# EAGLE design 24x16_RGB (EAGLE 6.5.0)

## Sheet 1 of 7
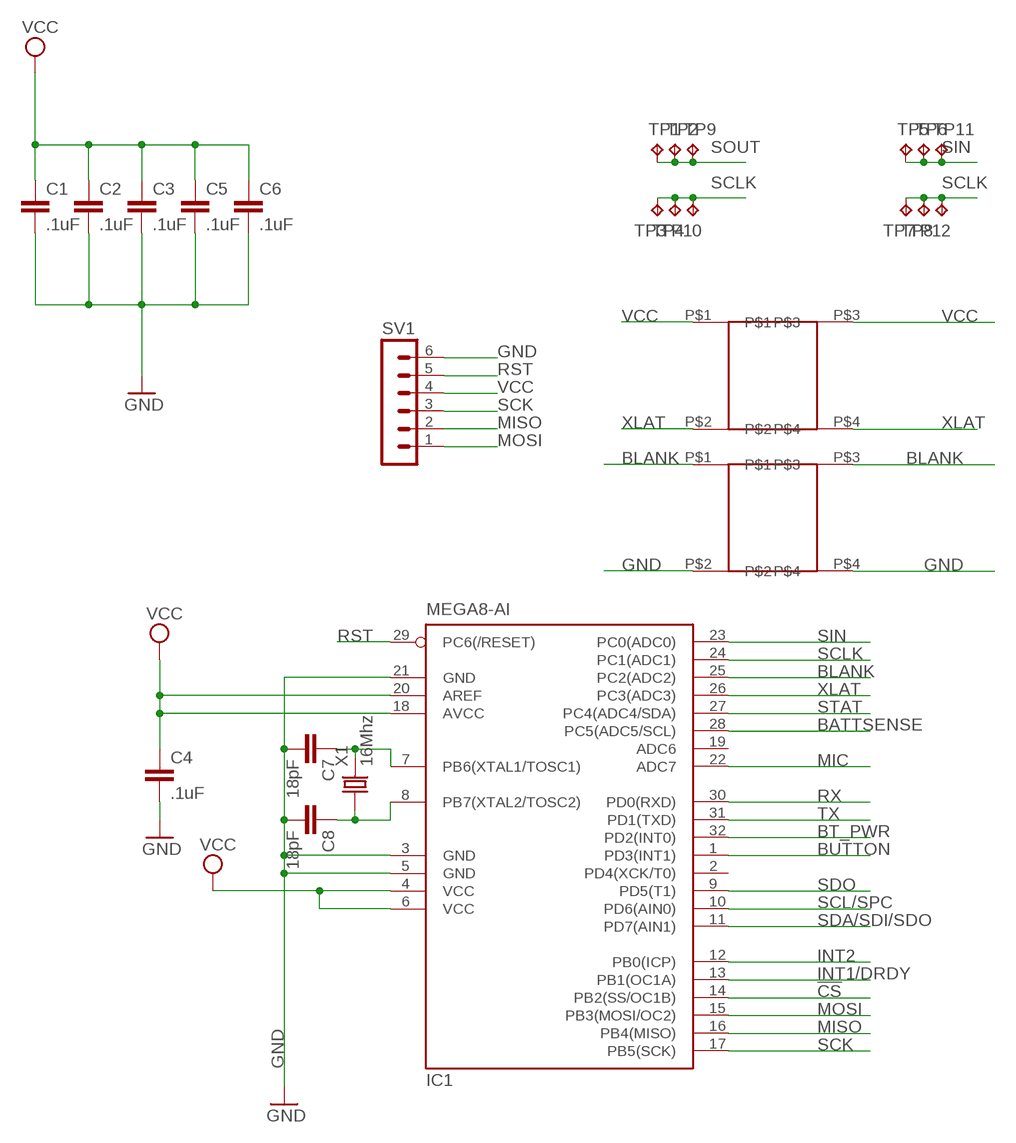
[diagram p0: schematic, sheet 1]

### Parts
C1  .1uF  CAP0805  [0805]
C2  .1uF  CAP0805  [0805]
C3  .1uF  CAP0805  [0805]
C4  .1uF  CAP0805  [0805]
C5  .1uF  CAP0805  [0805]
C6  .1uF  CAP0805  [0805]
C7  18pF  CAP0805  [0805]
C8  18pF  CAP0805  [0805]
IC1  MEGA8-AI  [TQFP32-08]
SLOT1  SLOT  [SLOT]
SLOT2  SLOT  [SLOT]
SV1  MA06-1  [MA06-1]
TP1  TPTP20SQ  [TP20SQ]
TP2  TPTP20SQ  [TP20SQ]
TP3  TPTP20SQ  [TP20SQ]
TP4  TPTP20SQ  [TP20SQ]
TP5  TPTP20SQ  [TP20SQ]
TP6  TPTP20SQ  [TP20SQ]
TP7  TPTP20SQ  [TP20SQ]
TP8  TPTP20SQ  [TP20SQ]
TP9  TPTP20SQ  [TP20SQ]
TP10  TPTP20SQ  [TP20SQ]
TP11  TPTP20SQ  [TP20SQ]
TP12  TPTP20SQ  [TP20SQ]
X1  16Mhz  CRYSTAL-5032  [5032]

### Nets
!CS: IC1.14(PB2(SS/OC1B)) ; also sheet 6
BATTSENSE: IC1.28(PC5(ADC5/SCL)) ; also sheet 4
BLANK: IC1.25(PC2(ADC2)) SLOT2.P$1 SLOT2.P$3 ; also sheet 2
BT_PWR: IC1.32(PD2(INT0)) ; also sheet 5
BUTTON: IC1.1(PD3(INT1)) ; also sheet 6
GND: C1.2 C2.2 C3.2 C4.2 C5.2 C6.2 C7.2 C8.2 IC1.3(GND) IC1.5(GND) IC1.21(GND) SLOT2.P$2 SLOT2.P$4 SV1.6 ; also sheet 2,4,5,6,7
INT1/DRDY: IC1.13(PB1(OC1A)) ; also sheet 6
INT2: IC1.12(PB0(ICP)) ; also sheet 6
MIC: IC1.22(ADC7) ; also sheet 7
MISO: IC1.16(PB4(MISO)) SV1.2
MOSI: IC1.15(PB3(MOSI/OC2)) SV1.1
N$7: C7.1 IC1.7(PB6(XTAL1/TOSC1)) X1.2
N$8: C8.1 IC1.8(PB7(XTAL2/TOSC2)) X1.1
RST: IC1.29(PC6(/RESET)) SV1.5 ; also sheet 6
RX: IC1.30(PD0(RXD)) ; also sheet 5
SCK: IC1.17(PB5(SCK)) SV1.3
SCL/SPC: IC1.10(PD6(AIN0)) ; also sheet 6
SCLK: IC1.24(PC1(ADC1)) TP3.TP TP4.TP TP7.TP TP8.TP TP10.TP TP12.TP ; also sheet 2
SDA/SDI/SDO: IC1.11(PD7(AIN1)) ; also sheet 6
SDO: IC1.9(PD5(T1)) ; also sheet 6
SIN: IC1.23(PC0(ADC0)) TP5.TP TP6.TP TP11.TP ; also sheet 2
SOUT: TP1.TP TP2.TP TP9.TP ; also sheet 2
STAT: IC1.27(PC4(ADC4/SDA)) ; also sheet 4
TX: IC1.31(PD1(TXD)) ; also sheet 5
VCC: C1.1 C2.1 C3.1 C4.1 C5.1 C6.1 IC1.4(VCC) IC1.6(VCC) IC1.18(AVCC) IC1.20(AREF) SLOT1.P$1 SLOT1.P$3 SV1.4 ; also sheet 2,3,4,5,6,7
XLAT: IC1.26(PC3(ADC3)) SLOT1.P$2 SLOT1.P$4 ; also sheet 2
Unconnected: IC1.2(PD4(XCK/T0)) IC1.19(ADC6)

## Sheet 2 of 7
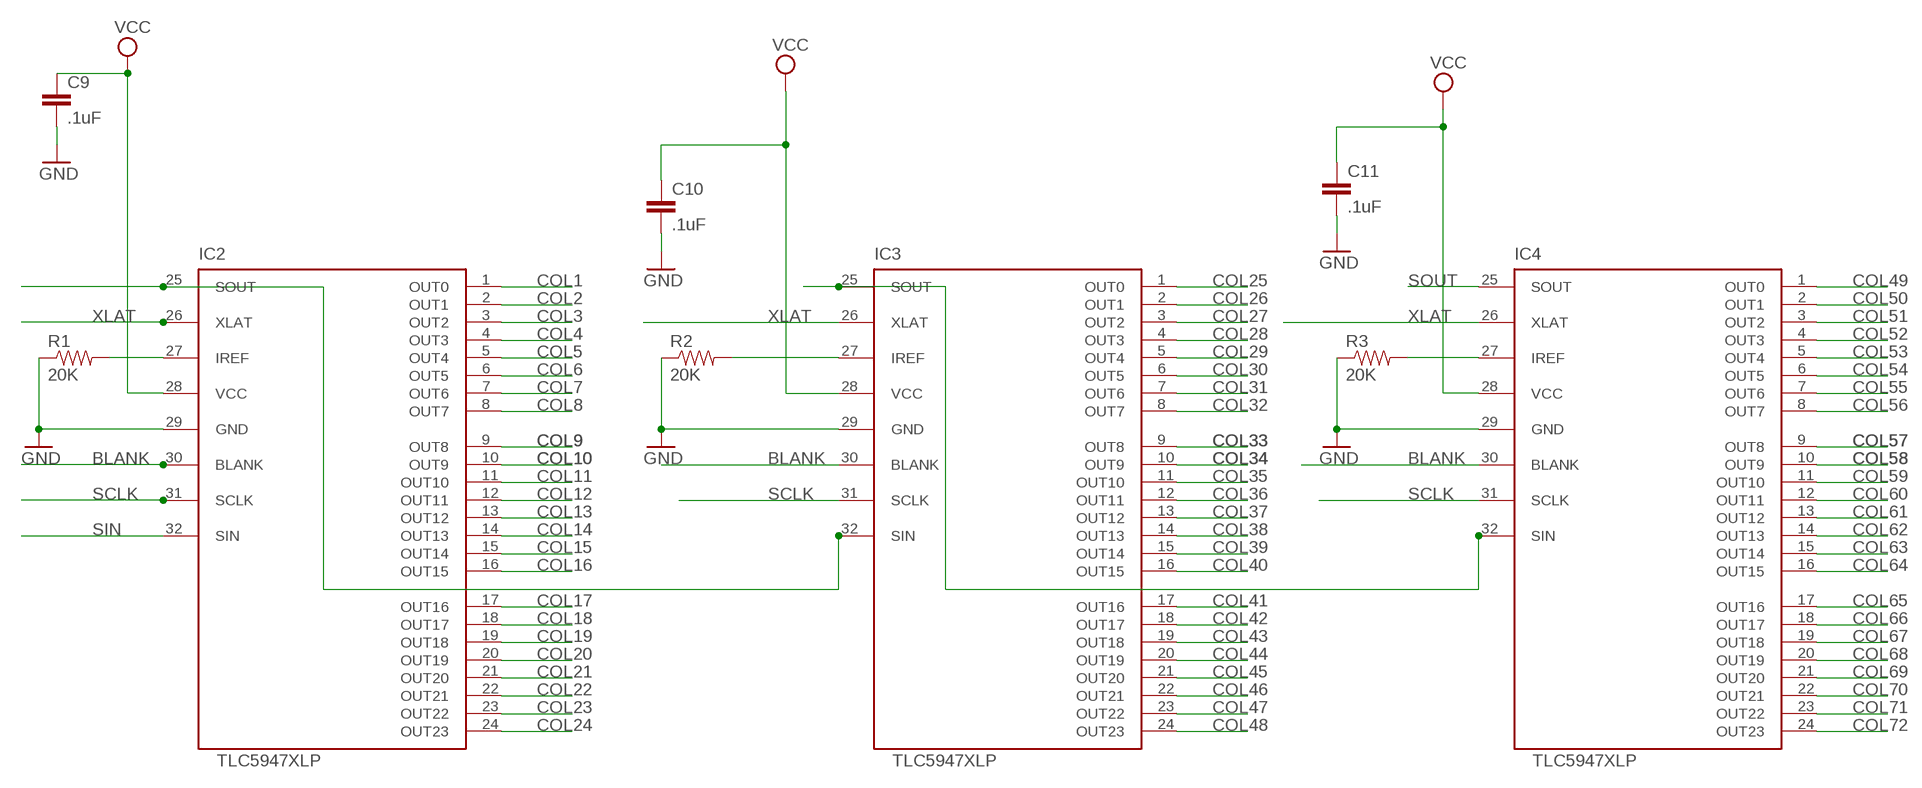
[diagram p1: schematic, sheet 2]

### Parts
C9  .1uF  CAP0805  [0805]
C10  .1uF  CAP0805  [0805]
C11  .1uF  CAP0805  [0805]
IC2  TLC5947XLP  [QFN32_XLP]
IC3  TLC5947XLP  [QFN32_XLP]
IC4  TLC5947XLP  [QFN32_XLP]
R1  20K  RESISTOR  [0805]
R2  20K  RESISTOR  [0805]
R3  20K  RESISTOR  [0805]

### Nets
BLANK: IC2.30(BLANK) IC3.30(BLANK) IC4.30(BLANK) ; also sheet 1
COL1: IC2.1(OUT0) ; also sheet 3
COL2: IC2.2(OUT1) ; also sheet 3
COL3: IC2.3(OUT2) ; also sheet 3
COL4: IC2.4(OUT3) ; also sheet 3
COL5: IC2.5(OUT4) ; also sheet 3
COL6: IC2.6(OUT5) ; also sheet 3
COL7: IC2.7(OUT6) ; also sheet 3
COL8: IC2.8(OUT7) ; also sheet 3
COL9: IC2.9(OUT8) ; also sheet 3
COL10: IC2.10(OUT9) ; also sheet 3
COL11: IC2.11(OUT10) ; also sheet 3
COL12: IC2.12(OUT11) ; also sheet 3
COL13: IC2.13(OUT12) ; also sheet 3
COL14: IC2.14(OUT13) ; also sheet 3
COL15: IC2.15(OUT14) ; also sheet 3
COL16: IC2.16(OUT15) ; also sheet 3
COL17: IC2.17(OUT16) ; also sheet 3
COL18: IC2.18(OUT17) ; also sheet 3
COL19: IC2.19(OUT18) ; also sheet 3
COL20: IC2.20(OUT19) ; also sheet 3
COL21: IC2.21(OUT20) ; also sheet 3
COL22: IC2.22(OUT21) ; also sheet 3
COL23: IC2.23(OUT22) ; also sheet 3
COL24: IC2.24(OUT23) ; also sheet 3
COL25: IC3.1(OUT0) ; also sheet 3
COL26: IC3.2(OUT1) ; also sheet 3
COL27: IC3.3(OUT2) ; also sheet 3
COL28: IC3.4(OUT3) ; also sheet 3
COL29: IC3.5(OUT4) ; also sheet 3
COL30: IC3.6(OUT5) ; also sheet 3
COL31: IC3.7(OUT6) ; also sheet 3
COL32: IC3.8(OUT7) ; also sheet 3
COL33: IC3.9(OUT8) ; also sheet 3
COL34: IC3.10(OUT9) ; also sheet 3
COL35: IC3.11(OUT10) ; also sheet 3
COL36: IC3.12(OUT11) ; also sheet 3
COL37: IC3.13(OUT12) ; also sheet 3
COL38: IC3.14(OUT13) ; also sheet 3
COL39: IC3.15(OUT14) ; also sheet 3
COL40: IC3.16(OUT15) ; also sheet 3
COL41: IC3.17(OUT16) ; also sheet 3
COL42: IC3.18(OUT17) ; also sheet 3
COL43: IC3.19(OUT18) ; also sheet 3
COL44: IC3.20(OUT19) ; also sheet 3
COL45: IC3.21(OUT20) ; also sheet 3
COL46: IC3.22(OUT21) ; also sheet 3
COL47: IC3.23(OUT22) ; also sheet 3
COL48: IC3.24(OUT23) ; also sheet 3
COL49: IC4.1(OUT0) ; also sheet 3
COL50: IC4.2(OUT1) ; also sheet 3
COL51: IC4.3(OUT2) ; also sheet 3
COL52: IC4.4(OUT3) ; also sheet 3
COL53: IC4.5(OUT4) ; also sheet 3
COL54: IC4.6(OUT5) ; also sheet 3
COL55: IC4.7(OUT6) ; also sheet 3
COL56: IC4.8(OUT7) ; also sheet 3
COL57: IC4.9(OUT8) ; also sheet 3
COL58: IC4.10(OUT9) ; also sheet 3
COL59: IC4.11(OUT10) ; also sheet 3
COL60: IC4.12(OUT11) ; also sheet 3
COL61: IC4.13(OUT12) ; also sheet 3
COL62: IC4.14(OUT13) ; also sheet 3
COL63: IC4.15(OUT14) ; also sheet 3
COL64: IC4.16(OUT15) ; also sheet 3
COL65: IC4.17(OUT16) ; also sheet 3
COL66: IC4.18(OUT17) ; also sheet 3
COL67: IC4.19(OUT18) ; also sheet 3
COL68: IC4.20(OUT19) ; also sheet 3
COL69: IC4.21(OUT20) ; also sheet 3
COL70: IC4.22(OUT21) ; also sheet 3
COL71: IC4.23(OUT22) ; also sheet 3
COL72: IC4.24(OUT23) ; also sheet 3
GND: C9.2 C10.2 C11.2 IC2.29(GND) IC3.29(GND) IC4.29(GND) R1.1 R2.1 R3.1 ; also sheet 1,4,5,6,7
HOLE: IC2.27(IREF) R1.2
N$2: IC3.27(IREF) R2.2
N$3: IC2.25(SOUT) IC3.32(SIN)
N$9: IC4.27(IREF) R3.2
N$19: IC3.25(SOUT) IC4.32(SIN)
SCLK: IC2.31(SCLK) IC3.31(SCLK) IC4.31(SCLK) ; also sheet 1
SIN: IC2.32(SIN) ; also sheet 1
SOUT: IC4.25(SOUT) ; also sheet 1
VCC: C9.1 C10.1 C11.1 IC2.28(VCC) IC3.28(VCC) IC4.28(VCC) ; also sheet 1,3,4,5,6,7
XLAT: IC2.26(XLAT) IC3.26(XLAT) IC4.26(XLAT) ; also sheet 1

## Sheet 3 of 7
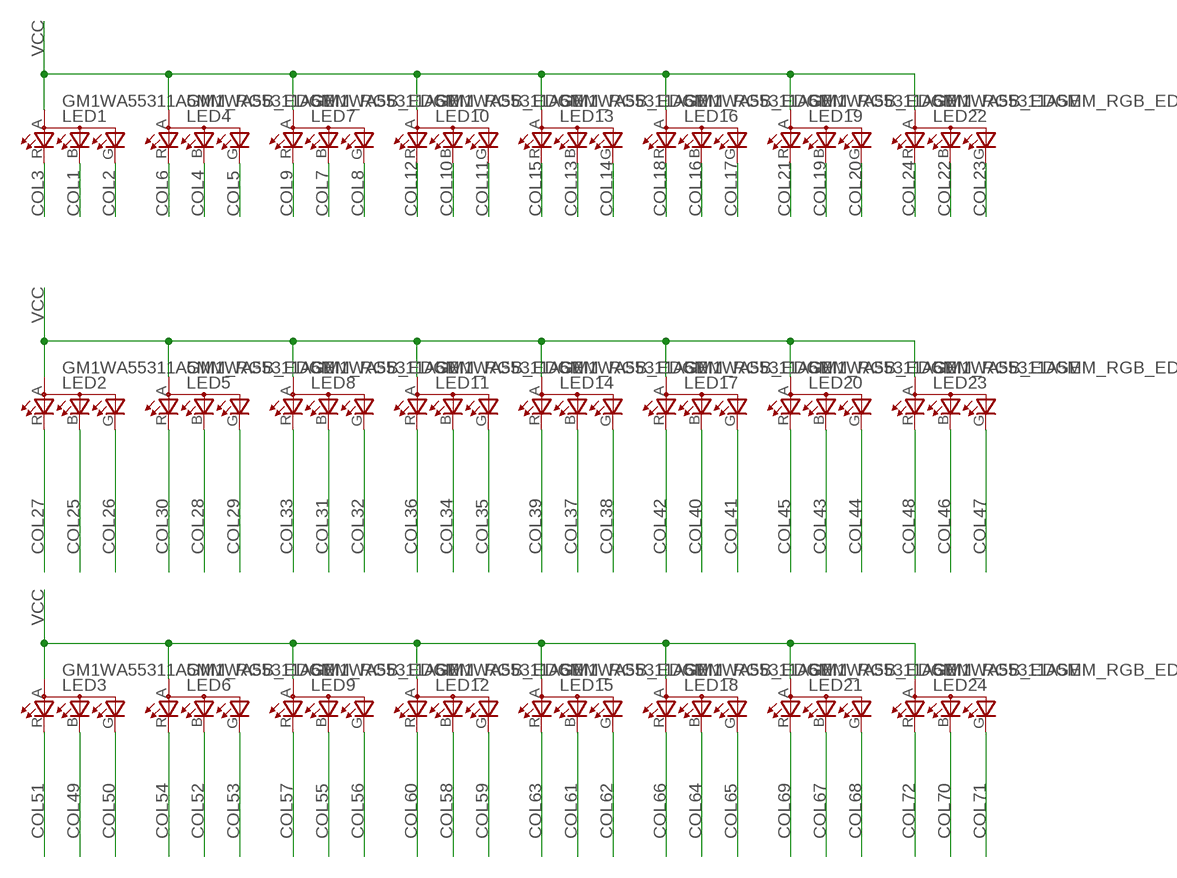
[diagram p2: schematic, sheet 3]

### Parts
LED1  GM1WA55311A5MM_RGB_EDGE  [LED5MM_RGB_EDGE]
LED2  GM1WA55311A5MM_RGB_EDGE  [LED5MM_RGB_EDGE]
LED3  GM1WA55311A5MM_RGB_EDGE  [LED5MM_RGB_EDGE]
LED4  GM1WA55311A5MM_RGB_EDGE  [LED5MM_RGB_EDGE]
LED5  GM1WA55311A5MM_RGB_EDGE  [LED5MM_RGB_EDGE]
LED6  GM1WA55311A5MM_RGB_EDGE  [LED5MM_RGB_EDGE]
LED7  GM1WA55311A5MM_RGB_EDGE  [LED5MM_RGB_EDGE]
LED8  GM1WA55311A5MM_RGB_EDGE  [LED5MM_RGB_EDGE]
LED9  GM1WA55311A5MM_RGB_EDGE  [LED5MM_RGB_EDGE]
LED10  GM1WA55311A5MM_RGB_EDGE  [LED5MM_RGB_EDGE]
LED11  GM1WA55311A5MM_RGB_EDGE  [LED5MM_RGB_EDGE]
LED12  GM1WA55311A5MM_RGB_EDGE  [LED5MM_RGB_EDGE]
LED13  GM1WA55311A5MM_RGB_EDGE  [LED5MM_RGB_EDGE]
LED14  GM1WA55311A5MM_RGB_EDGE  [LED5MM_RGB_EDGE]
LED15  GM1WA55311A5MM_RGB_EDGE  [LED5MM_RGB_EDGE]
LED16  GM1WA55311A5MM_RGB_EDGE  [LED5MM_RGB_EDGE]
LED17  GM1WA55311A5MM_RGB_EDGE  [LED5MM_RGB_EDGE]
LED18  GM1WA55311A5MM_RGB_EDGE  [LED5MM_RGB_EDGE]
LED19  GM1WA55311A5MM_RGB_EDGE  [LED5MM_RGB_EDGE]
LED20  GM1WA55311A5MM_RGB_EDGE  [LED5MM_RGB_EDGE]
LED21  GM1WA55311A5MM_RGB_EDGE  [LED5MM_RGB_EDGE]
LED22  GM1WA55311A5MM_RGB_EDGE  [LED5MM_RGB_EDGE]
LED23  GM1WA55311A5MM_RGB_EDGE  [LED5MM_RGB_EDGE]
LED24  GM1WA55311A5MM_RGB_EDGE  [LED5MM_RGB_EDGE]

### Nets
COL1: LED1.B(CBLUE) ; also sheet 2
COL2: LED1.G(CGREEN) ; also sheet 2
COL3: LED1.R(CRED) ; also sheet 2
COL4: LED4.B(CBLUE) ; also sheet 2
COL5: LED4.G(CGREEN) ; also sheet 2
COL6: LED4.R(CRED) ; also sheet 2
COL7: LED7.B(CBLUE) ; also sheet 2
COL8: LED7.G(CGREEN) ; also sheet 2
COL9: LED7.R(CRED) ; also sheet 2
COL10: LED10.B(CBLUE) ; also sheet 2
COL11: LED10.G(CGREEN) ; also sheet 2
COL12: LED10.R(CRED) ; also sheet 2
COL13: LED13.B(CBLUE) ; also sheet 2
COL14: LED13.G(CGREEN) ; also sheet 2
COL15: LED13.R(CRED) ; also sheet 2
COL16: LED16.B(CBLUE) ; also sheet 2
COL17: LED16.G(CGREEN) ; also sheet 2
COL18: LED16.R(CRED) ; also sheet 2
COL19: LED19.B(CBLUE) ; also sheet 2
COL20: LED19.G(CGREEN) ; also sheet 2
COL21: LED19.R(CRED) ; also sheet 2
COL22: LED22.B(CBLUE) ; also sheet 2
COL23: LED22.G(CGREEN) ; also sheet 2
COL24: LED22.R(CRED) ; also sheet 2
COL25: LED2.B(CBLUE) ; also sheet 2
COL26: LED2.G(CGREEN) ; also sheet 2
COL27: LED2.R(CRED) ; also sheet 2
COL28: LED5.B(CBLUE) ; also sheet 2
COL29: LED5.G(CGREEN) ; also sheet 2
COL30: LED5.R(CRED) ; also sheet 2
COL31: LED8.B(CBLUE) ; also sheet 2
COL32: LED8.G(CGREEN) ; also sheet 2
COL33: LED8.R(CRED) ; also sheet 2
COL34: LED11.B(CBLUE) ; also sheet 2
COL35: LED11.G(CGREEN) ; also sheet 2
COL36: LED11.R(CRED) ; also sheet 2
COL37: LED14.B(CBLUE) ; also sheet 2
COL38: LED14.G(CGREEN) ; also sheet 2
COL39: LED14.R(CRED) ; also sheet 2
COL40: LED17.B(CBLUE) ; also sheet 2
COL41: LED17.G(CGREEN) ; also sheet 2
COL42: LED17.R(CRED) ; also sheet 2
COL43: LED20.B(CBLUE) ; also sheet 2
COL44: LED20.G(CGREEN) ; also sheet 2
COL45: LED20.R(CRED) ; also sheet 2
COL46: LED23.B(CBLUE) ; also sheet 2
COL47: LED23.G(CGREEN) ; also sheet 2
COL48: LED23.R(CRED) ; also sheet 2
COL49: LED3.B(CBLUE) ; also sheet 2
COL50: LED3.G(CGREEN) ; also sheet 2
COL51: LED3.R(CRED) ; also sheet 2
COL52: LED6.B(CBLUE) ; also sheet 2
COL53: LED6.G(CGREEN) ; also sheet 2
COL54: LED6.R(CRED) ; also sheet 2
COL55: LED9.B(CBLUE) ; also sheet 2
COL56: LED9.G(CGREEN) ; also sheet 2
COL57: LED9.R(CRED) ; also sheet 2
COL58: LED12.B(CBLUE) ; also sheet 2
COL59: LED12.G(CGREEN) ; also sheet 2
COL60: LED12.R(CRED) ; also sheet 2
COL61: LED15.B(CBLUE) ; also sheet 2
COL62: LED15.G(CGREEN) ; also sheet 2
COL63: LED15.R(CRED) ; also sheet 2
COL64: LED18.B(CBLUE) ; also sheet 2
COL65: LED18.G(CGREEN) ; also sheet 2
COL66: LED18.R(CRED) ; also sheet 2
COL67: LED21.B(CBLUE) ; also sheet 2
COL68: LED21.G(CGREEN) ; also sheet 2
COL69: LED21.R(CRED) ; also sheet 2
COL70: LED24.B(CBLUE) ; also sheet 2
COL71: LED24.G(CGREEN) ; also sheet 2
COL72: LED24.R(CRED) ; also sheet 2
VCC: LED1.A LED2.A LED3.A LED4.A LED5.A LED6.A LED7.A LED8.A LED9.A LED10.A LED11.A LED12.A LED13.A LED14.A LED15.A LED16.A LED17.A LED18.A LED19.A LED20.A LED21.A LED22.A LED23.A LED24.A ; also sheet 1,2,4,5,6,7

## Sheet 4 of 7
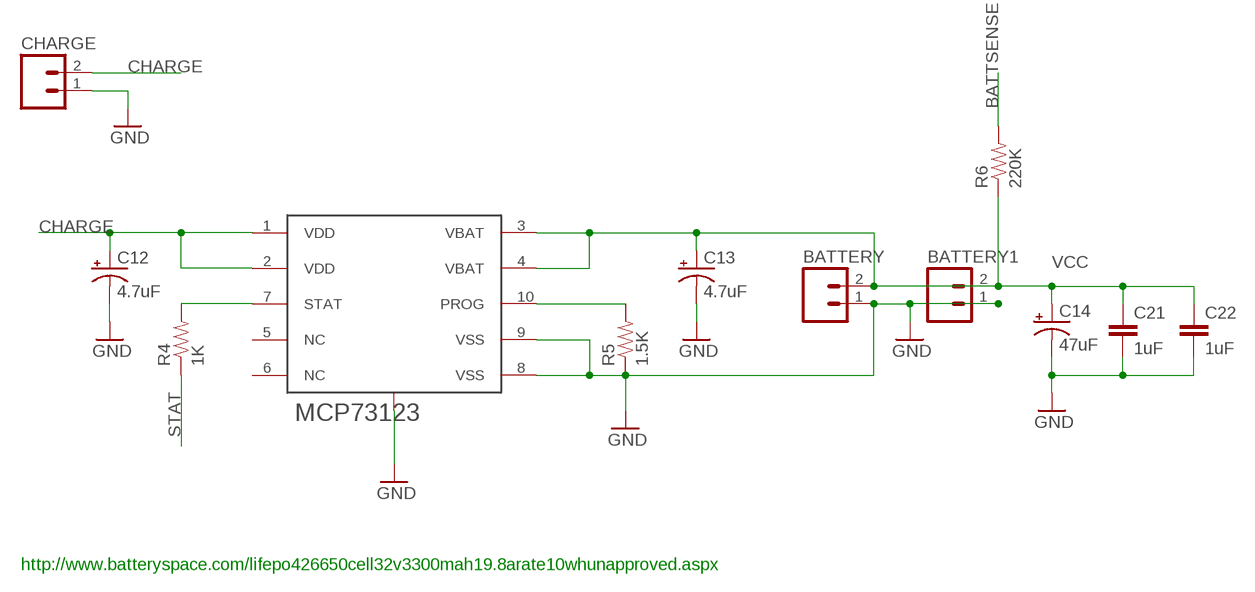
[diagram p3: schematic, sheet 4]

### Parts
BATTERY  M02PTH  [1X02]
BATTERY1  M02PTH  [1X02]
C12  4.7uF  CAP_POL3528  [EIA3528]
C13  4.7uF  CAP_POL3528  [EIA3528]
C14  47uF  CAP_POL3528  [EIA3528]
C21  1uF  CAP0805  [0805]
C22  1uF  CAP0805  [0805]
CHARGE  M02PTH  [1X02]
IC5  MCP73123  [DFN10_3X3]
R4  1K  RESISTOR0805  [0805]
R5  1.5K  RESISTOR0805  [0805]
R6  220K  RESISTOR0805  [0805]

### Nets
BATTSENSE: R6.2 ; also sheet 1
CHARGE: C12.A(+) CHARGE.2 IC5.1(VDD) IC5.2(VDD)
GND: BATTERY1.1 BATTERY.1 C12.C(-) C13.C(-) C14.C(-) C21.2 C22.2 CHARGE.1 IC5.8(VSS) IC5.9(VSS) IC5.EXP(GND) R5.1 ; also sheet 1,2,5,6,7
N$1: IC5.7(STAT) R4.2
N$6: IC5.10(PROG) R5.2
STAT: R4.1 ; also sheet 1
VCC: BATTERY1.2 BATTERY.2 C13.A(+) C14.A(+) C21.1 C22.1 IC5.3(VBAT) IC5.4(VBAT) R6.1 ; also sheet 1,2,3,5,6,7
Unconnected: IC5.5(NC) IC5.6(NC)

### Notes on the sheet
- http://www.batteryspace.com/lifepo426650cell32v3300mah19.8arate10whunapproved.aspx

## Sheet 5 of 7
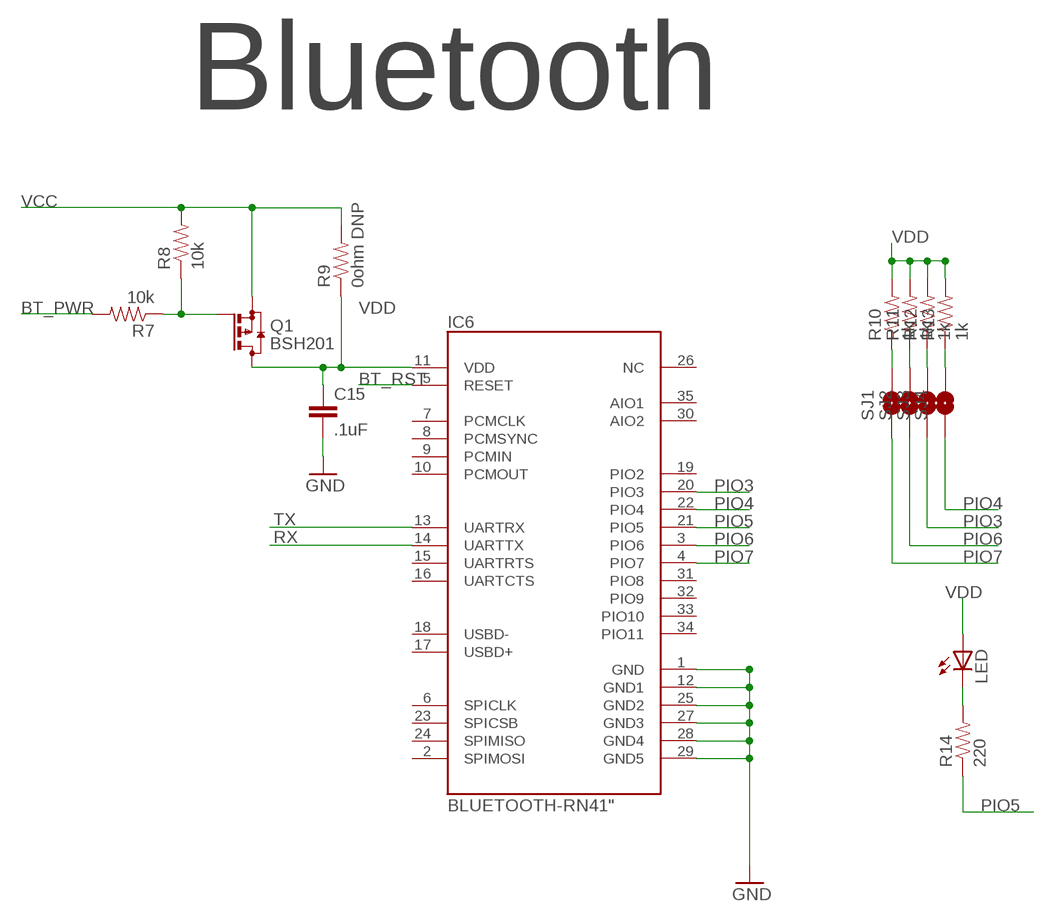
[diagram p4: schematic, sheet 5]

### Parts
C15  .1uF  CAP0805  [0805]
IC6  BLUETOOTH-RN41"  [RN41]
LED  LEDCHIP-LED0603  [CHIP-LED0603]
Q1  BSH201  BSS84  [SOT23]
R7  10k  RESISTOR  [0805]
R8  10k  RESISTOR  [0805]
R9  0ohm DNP  RESISTOR  [0805]
R10  1k  RESISTOR  [0805]
R11  1k  RESISTOR  [0805]
R12  1k  RESISTOR  [0805]
R13  1k  RESISTOR  [0805]
R14  220  RESISTOR  [0805]
SJ1  SOLDERJUMPERNO  [SJ_2S-NO]
SJ2  SOLDERJUMPERNO  [SJ_2S-NO]
SJ3  SOLDERJUMPERNO  [SJ_2S-NO]
SJ4  SOLDERJUMPERNO  [SJ_2S-NO]

### Nets
BT_PWR: R7.2 ; also sheet 1
BT_RST: IC6.5(RESET) ; also sheet 6
GND: C15.2 IC6.1(GND) IC6.12(GND1) IC6.25(GND2) IC6.27(GND3) IC6.28(GND4) IC6.29(GND5) ; also sheet 1,2,4,6,7
N$4: LED.C R14.2
N$5: R10.1 SJ1.2
N$18: Q1.1(G) R7.1 R8.1
N$21: R12.1 SJ3.2
N$23: R11.1 SJ2.2
N$24: R13.1 SJ4.2
PIO3: IC6.20(PIO3) SJ3.1
PIO4: IC6.22(PIO4) SJ4.1
PIO5: IC6.21(PIO5) R14.1
PIO6: IC6.3(PIO6) SJ2.1
PIO7: IC6.4(PIO7) SJ1.1
RX: IC6.14(UARTTX) ; also sheet 1
TX: IC6.13(UARTRX) ; also sheet 1
VCC: Q1.2(S) R8.2 R9.2 ; also sheet 1,2,3,4,6,7
VDD: C15.1 IC6.11(VDD) LED.A Q1.3(D) R9.1 R10.2 R11.2 R12.2 R13.2
Unconnected: IC6.2(SPIMOSI) IC6.6(SPICLK) IC6.7(PCMCLK) IC6.8(PCMSYNC) IC6.9(PCMIN) IC6.10(PCMOUT) IC6.15(UARTRTS) IC6.16(UARTCTS) IC6.17(USBD+) IC6.18(USBD-) IC6.19(PIO2) IC6.23(SPICSB) IC6.24(SPIMISO) IC6.26(NC) IC6.30(AIO2) IC6.31(PIO8) IC6.32(PIO9) IC6.33(PIO10) IC6.34(PIO11) IC6.35(AIO1)

### Notes on the sheet
- Bluetooth

## Sheet 6 of 7
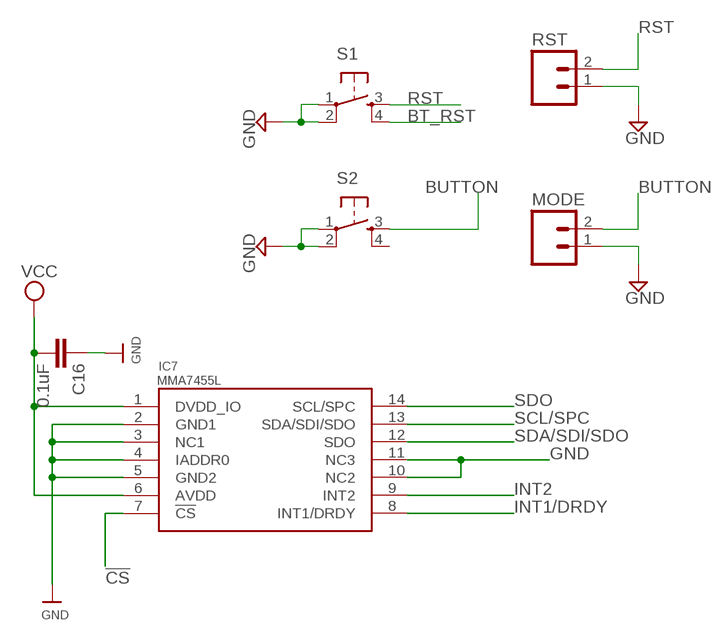
[diagram p5: schematic, sheet 6]

### Parts
C16  0.1uF  CAP0805  [0805]
IC7  MMA7455L  [LGA-14]
MODE  M02PTH  [1X02]
RST  M02PTH  [1X02]
S1  TAC_SWITCHSMD  [TACTILE_SWITCH_SMD]
S2  TAC_SWITCHSMD  [TACTILE_SWITCH_SMD]

### Nets
!CS: IC7.7(!CS) ; also sheet 1
BT_RST: S1.4 ; also sheet 5
BUTTON: MODE.2 S2.3 ; also sheet 1
GND: C16.1 IC7.2(GND1) IC7.3(NC1) IC7.4(IADDR0) IC7.5(GND2) IC7.10(NC2) IC7.11(NC3) MODE.1 RST.1 S1.1 S1.2 S2.1 S2.2 ; also sheet 1,2,4,5,7
INT1/DRDY: IC7.8(INT1/DRDY) ; also sheet 1
INT2: IC7.9(INT2) ; also sheet 1
RST: RST.2 S1.3 ; also sheet 1
SCL/SPC: IC7.13(SDA/SDI/SDO) ; also sheet 1
SDA/SDI/SDO: IC7.12(SDO) ; also sheet 1
SDO: IC7.14(SCL/SPC) ; also sheet 1
VCC: C16.2 IC7.1(DVDD_IO) IC7.6(AVDD) ; also sheet 1,2,3,4,5,7
Unconnected: S2.4

## Sheet 7 of 7
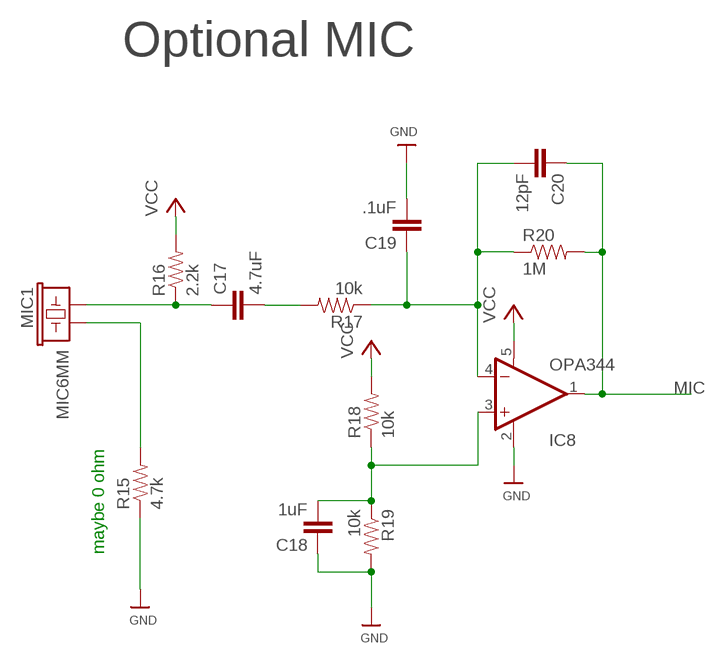
[diagram p6: schematic, sheet 7]

### Parts
C17  4.7uF  CAP0805  [0805]
C18  1uF  CAP0805  [0805]
C19  .1uF  CAP0805  [0805]
C20  12pF  CAP0805  [0805]
IC8  OPA344  [SOT23-5]
MIC1  MIC6MM  [MIC-6MM]
R15  4.7k  RESISTOR  [0805]
R16  2.2k  RESISTOR  [0805]
R17  10k  RESISTOR  [0805]
R18  10k  RESISTOR  [0805]
R19  10k  RESISTOR  [0805]
R20  1M  RESISTOR  [0805]

### Nets
GND: C18.1 C19.2 IC8.2(V-) R15.1 R19.2 ; also sheet 1,2,4,5,6
MIC: C20.1 IC8.1(OUT) R20.2 ; also sheet 1
N$14: C17.2 R17.2
N$15: C17.1 MIC1.1 R16.1
N$16: C18.2 IC8.3(+IN) R18.1 R19.1
N$17: C19.1 C20.2 IC8.4(-IN) R17.1 R20.1
N$20: MIC1.2 R15.2
VCC: IC8.5(V+) R16.2 R18.2 ; also sheet 1,2,3,4,5,6

### Notes on the sheet
- Optional MIC
- maybe 0 ohm

## Library data of the parts
BATTERY BATTERY1 CHARGE = SparkFun:M02: Header 2 Standard 2-pin 0.1" header. Use with straight break away headers (SKU : PRT-00116), right angle break away headers (PRT-00553), swiss pins (PRT-00743), machine pins (PRT-00117), and female headers (PRT-00115). Molex polarized connector foot print use with SKU : PRT-08233 with associated crimp pins and housings.; OC_NEWARK: unknown
C1-C6 C9-C11 = slice_noshift:CAP: Capacitor Standard 0603 ceramic capacitor, and 0.1" leaded capacitor.; MPN: 08055C105MAT2A; OC_NEWARK: 73T5385
C7 C8 = slice_noshift:CAP: Capacitor Standard 0603 ceramic capacitor, and 0.1" leaded capacitor.; MPN: 08051A180JAT2A; OC_NEWARK: 96M1325
C12 C13 = slice_noshift:CAP_POL: Capacitor Polarized These are standard SMD and PTH capacitors. Normally 10uF, 47uF, and 100uF in electrolytic and tantalum varieties. Always verify the external diameter of the through hole cap, it varies with capacity, voltage, and manufacturer. The EIA devices should be standard.; MPN: 0805YD475KAT2A; OC_NEWARK: 96M1306
C14 = slice_noshift:CAP_POL: Capacitor Polarized These are standard SMD and PTH capacitors. Normally 10uF, 47uF, and 100uF in electrolytic and tantalum varieties. Always verify the external diameter of the through hole cap, it varies with capacity, voltage, and manufacturer. The EIA devices should be standard.; OC_NEWARK: unknown
C15 C19 = SparkFun:CAP: Capacitor Standard 0603 ceramic capacitor, and 0.1" leaded capacitor.; MPN: 08055C105MAT2A; OC_NEWARK: 73T5385
C16 = SparkFun:CAP: Capacitor Standard 0603 ceramic capacitor, and 0.1" leaded capacitor.; MPN: 08055C104K4T2A; OC_NEWARK: 95W2729
C17 = SparkFun:CAP: Capacitor Standard 0603 ceramic capacitor, and 0.1" leaded capacitor.; MPN: 08053D475KAT2A; OC_NEWARK: 15P4053
C18 = SparkFun:CAP: Capacitor Standard 0603 ceramic capacitor, and 0.1" leaded capacitor.; MPN: 08055D105KAT2A; OC_NEWARK: 66M3779
C20 = SparkFun:CAP: Capacitor Standard 0603 ceramic capacitor, and 0.1" leaded capacitor.; MF: AVX CORPORATION; MPN: 08055A120JAT2A; OC_NEWARK: 30H0781
C21 C22 = 24x16_RGB:CAP: Capacitor Standard 0603 ceramic capacitor, and 0.1" leaded capacitor.; MPN: 08055D105KAT2A; OC_NEWARK: 66M3779
IC1 = atmel:MEGA8: MICROCONTROLLER 8 Kbytes FLASH, 1 kbytes SRAM, 512 bytes EEPROM, USART, 6-channel 10 bit ADC, 2-channel 8 bit ADC Pin compatible with Atmega48, ATMega88, ATMega168 Source: avr.lbr; MPN: ATMEGA8-16AU; OC_FARNELL: 9171371; OC_NEWARK: unknown
IC2-IC4 = slice_noshift:TLC5947; OC_NEWARK: unknown
IC5 = 24x16_RGB:MCP73123; MPN: MCP73123T-22SI/MF; OC_NEWARK: 14R8877
IC6 = NSL_Mini_Quad:BLUETOOTH-RN41; OC_NEWARK: unknown
IC7 = MMA7455Lbreakoutboard-v1a:MMA7455L; MPN: MMA7455LR2; OC_NEWARK: 69M3900
IC8 = SparkFun:OPA344; MPN: OPA344NA/250G4; OC_NEWARK: 13M5179
LED = led:LED: LED OSRAM: - CHIPLED LG R971, LG N971, LY N971, LG Q971, LY Q971, LO R971, LY R971 LH N974, LH R974 LS Q976, LO Q976, LY Q976 LO Q996 - Hyper CHIPLED LW Q18S LB Q993, LB Q99A, LB R99A - SideLED LS A670, LO A670, LY A670, LG A670, LP A670 LB A673, LV A673, LT A673, LW A673 LH A674 LY A675 LS A676, LA A676, LO A676, LY A676, LW A676 LS A679, LY A679, LG A679 - Hyper Micro SIDELED® LS Y876, LA Y876, LO Y876, LY Y876 LT Y87S - SmartLED LW L88C, LW L88S LB L89C, LB L89S, LG L890 LS L89K, LO L89K, LY L89K LS L896, LA L896, LO L896, LY L896 - TOPLED LS T670, LO T670, LY T670, LG T670, LP T670 LSG T670, LSP T670, LSY T670, LOP T670, LYG T670 LG T671, LOG T671, LSG T671 LB T673, LV T673, LT T673, LW T673 LH T674 LS T676, LA T676, LO T676, LY T676, LB T676, LH T676, LSB T676, LW T676 LB T67C, LV T67C, LT T67C, LS T67K, LO T67K, LY T67K, LW E67C LS E67B, LA E67B, LO E67B, LY E67B, LB E67C, LV E67C, LT E67C LW T67C LS T679, LY T679, LG T679 LS T770, LO T770, LY T770, LG T770, LP T770 LB T773, LV T773, LT T773, LW T773 LH T774 LS E675, LA E675, LY E675, LS T675 LS T776, LA T776, LO T776, LY T776, LB T776 LHGB T686 LT T68C, LB T68C - Hyper Mini TOPLED® LB M676 - Mini TOPLED Santana® LG M470 LS M47K, LO M47K, LY M47K Source: http://www.osram.convergy.de LUXEON: - LUMILED® LXK2-PW12-R00, LXK2-PW12-S00, LXK2-PW14-U00, LXK2-PW14-V00 LXK2-PM12-R00, LXK2-PM12-S00, LXK2-PM14-U00 LXK2-PE12-Q00, LXK2-PE12-R00, LXK2-PE12-S00, LXK2-PE14-T00, LXK2-PE14-U00 LXK2-PB12-K00, LXK2-PB12-L00, LXK2-PB12-M00, LXK2-PB14-N00, LXK2-PB14-P00, LXK2-PB14-Q00 LXK2-PR12-L00, LXK2-PR12-M00, LXK2-PR14-Q00, LXK2-PR14-R00 LXK2-PD12-Q00, LXK2-PD12-R00, LXK2-PD12-S00 LXK2-PH12-R00, LXK2-PH12-S00 LXK2-PL12-P00, LXK2-PL12-Q00, LXK2-PL12-R00 Source: www.luxeon.com KINGBRIGHT: KA-3528ASYC Source: www.kingbright.com; OC_NEWARK: unknown
LED1-LED24 = 24x16_RGB:GM1WA55311A: Chip LED RGB Source: http://document.sharpsma.com/files/GM1WA55311A_SS.pdf; OC_NEWARK: unknown
MIC1 = slice_noshift:MIC: Microphone Omni-directional electret microphone. 9.7mm standard diameter.; OC_NEWARK: unknown
MODE RST = 24x16_RGB:M02: Header 2 Standard 2-pin 0.1" header. Use with straight break away headers (SKU : PRT-00116), right angle break away headers (PRT-00553), swiss pins (PRT-00743), machine pins (PRT-00117), and female headers (PRT-00115). Molex polarized connector foot print use with SKU : PRT-08233 with associated crimp pins and housings.; OC_NEWARK: unknown
Q1 = transistor-small-signal:BSS84: P-CHANNEL MOS FET; MPN: BSH201,215; OC_NEWARK: 79R1832
R1-R3 = 24x16_RGB:RESISTOR: Resistor Basic schematic elements and footprints for 0603, 1206, and PTH 1/10th watt (small) resistors.; OC_NEWARK: unknown
R4 = slice_noshift:RESISTOR: Resistor Basic schematic elements and footprints for 0603, 1206, and PTH 1/10th watt (small) resistors.; MF: VISHAY/DALE; MPN: CRCW08051K00FKEA; OC_NEWARK: 52K9723
R5 = slice_noshift:RESISTOR: Resistor Basic schematic elements and footprints for 0603, 1206, and PTH 1/10th watt (small) resistors.; OC_NEWARK: unknown
R6 = slice_noshift:RESISTOR: Resistor Basic schematic elements and footprints for 0603, 1206, and PTH 1/10th watt (small) resistors.; MPN: 08051A220KAT2A; OC_NEWARK: 96M1330
R7-R9 R14 R17-R20 = SparkFun:RESISTOR: Resistor Basic schematic elements and footprints for 0603, 1206, and PTH 1/10th watt (small) resistors.; OC_NEWARK: unknown
R10-R13 = SparkFun:RESISTOR: Resistor Basic schematic elements and footprints for 0603, 1206, and PTH 1/10th watt (small) resistors.; MF: VISHAY/DALE; MPN: CRCW08051K00FKTA; OC_NEWARK: 05F1507
R15 = SparkFun:RESISTOR: Resistor Basic schematic elements and footprints for 0603, 1206, and PTH 1/10th watt (small) resistors.; MPN: CRCW08054K70FKEA; OC_NEWARK: 61M5491
R16 = SparkFun:RESISTOR: Resistor Basic schematic elements and footprints for 0603, 1206, and PTH 1/10th watt (small) resistors.; MPN: CRCW08052K20FKEA; OC_NEWARK: 61M5457
S1 S2 = SparkFun:TAC_SWITCH: Momentary Switch Button commonly used for reset or general input. Spark Fun Electronics SKU : COM-00097; OC_NEWARK: unknown
SJ1-SJ4 = SparkFun:SOLDERJUMPER: Solder Jumper Standard SMD solder jumper. Used to automate production. Two varients : Normally Open and Normally Closed are the same, but have different paste layers. NC will have a large amount of paste and should jumper during reflow.; OC_NEWARK: unknown
SLOT1 SLOT2 = slice:SLOT; OC_NEWARK: unknown
SV1 = NSL:MA06-1: PIN HEADER; OC_NEWARK: unknown
TP1-TP12 = testpad:TP: Test pad; OC_NEWARK: unknown
X1 = NSL_MiniQuad:CRYSTAL*: CRYSTAL; OC_NEWARK: unknown

## Board
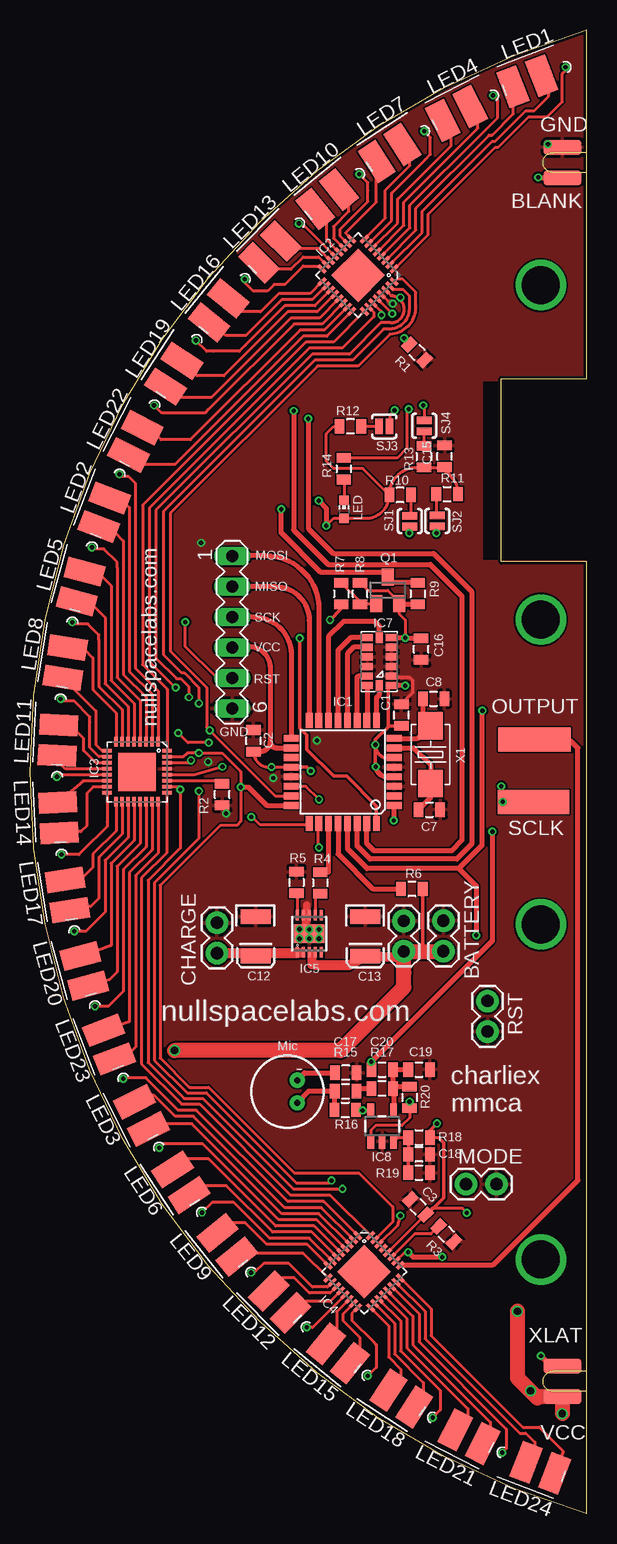
[diagram p7: board, top side]
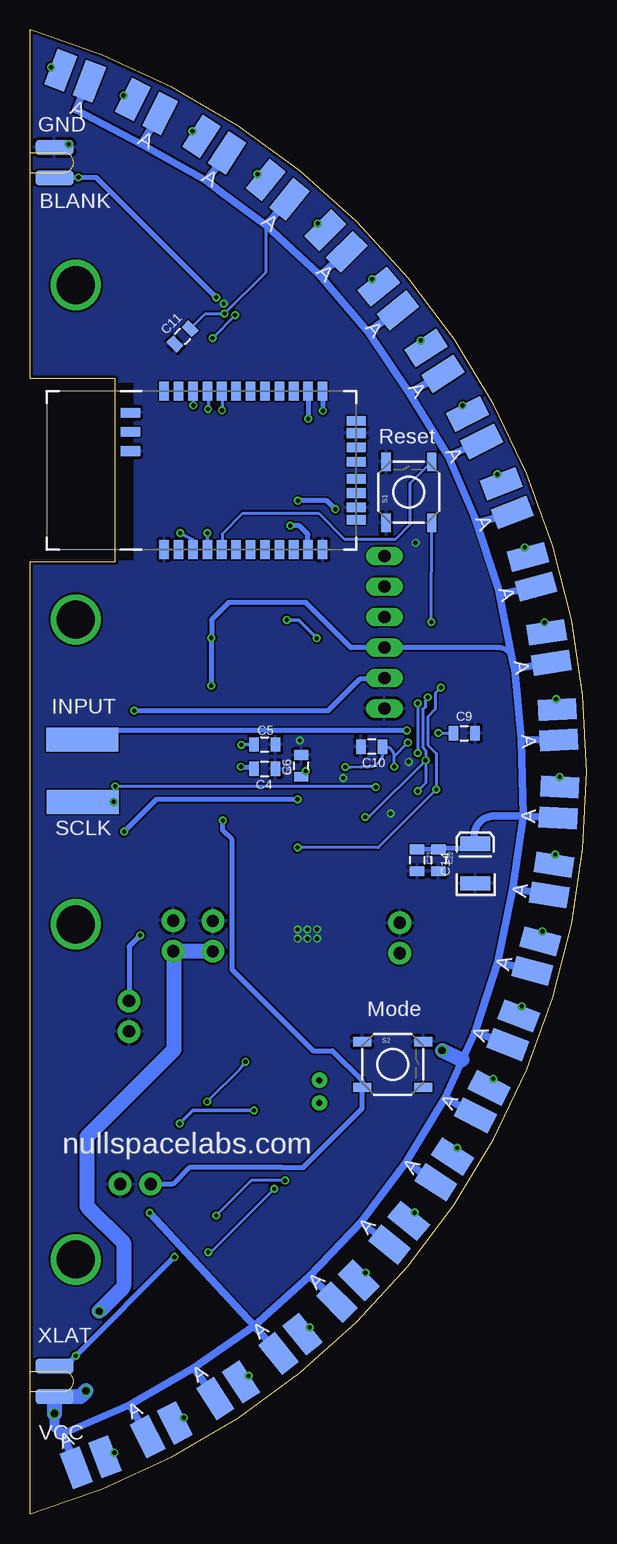
[diagram p8: board, bottom side, seen from below]

Size 46.39 x 123.7 mm. Coordinates in mm from the lower left corner, seen from the top.
Outline: 46.39,0 arc-147 46.39,123.7 46.39,94.61 39.27,94.61 39.27,79.38 46.39,79.38 46.39,0
Copper layers (1*16): Top 0.035mm / dielectric 1.5mm / Bottom 0.035mm
Design rules "ITead_rule": minimum track width 6mil, minimum drill 12mil, track to track 6mil, track to pad 6mil, pad to pad 6mil, via to via 6mil, smd to smd 0mil, copper to edge 10mil, drill to drill 10mil, minimum pad ring 10mil, minimum via ring 6mil, stop-mask expansion 2mil, vias tented up to drill 100mil, thermal gap 10mil

### Footprints (pad centres in the part's own frame; a part is rotated, then mirrored left to right if it is on the bottom)
1X02 = drill 1.016 pad 1.88: 1 0,0; 2 2.54,0
0805 = smd 0.8 x 1.2: 1 -0.9,0; 2 0.9,0
EIA3528 = smd 1.2 x 2.5: A 1.65,0; C -1.65,0
TQFP32-08 = smd 1.27 x 0.559: 1 -4.293,2.8; 2 -4.293,2; 3 -4.293,1.2; 4 -4.293,0.4; 5 -4.293,-0.4; 6 -4.293,-1.2; 7 -4.293,-2; 8 -4.293,-2.8; 17 4.293,-2.8; 18 4.293,-2; 19 4.293,-1.2; 20 4.293,-0.4; 21 4.293,0.4; 22 4.293,1.2; 23 4.293,2; 24 4.293,2.8 | smd 0.559 x 1.27: 9 -2.8,-4.293; 10 -2,-4.293; 11 -1.2,-4.293; 12 -0.4,-4.293; 13 0.4,-4.293; 14 1.2,-4.293; 15 2,-4.293; 16 2.8,-4.293; 25 2.8,4.293; 26 2,4.293; 27 1.2,4.293; 28 0.4,4.293; 29 -0.4,4.293; 30 -1.2,4.293; 31 -2,4.293; 32 -2.8,4.293
QFN32_XLP = smd 0.285 x 0.8: 1 -1.75,-2.5; 2 -1.25,-2.5; 3 -0.75,-2.5; 4 -0.25,-2.5; 5 0.25,-2.5; 6 0.75,-2.5; 7 1.25,-2.5; 8 1.75,-2.5; 17 1.75,2.5; 18 1.25,2.5; 19 0.75,2.5; 20 0.25,2.5; 21 -0.25,2.5; 22 -0.75,2.5; 23 -1.25,2.5; 24 -1.75,2.5 | smd 0.8 x 0.285: 9 2.5,-1.75; 10 2.5,-1.25; 11 2.5,-0.75; 12 2.5,-0.25; 13 2.5,0.25; 14 2.5,0.75; 15 2.5,1.25; 16 2.5,1.75; 25 -2.5,1.75; 26 -2.5,1.25; 27 -2.5,0.75; 28 -2.5,0.25; 29 -2.5,-0.25; 30 -2.5,-0.75; 31 -2.5,-1.25; 32 -2.5,-1.75 | smd 3.15 x 3.15: EP 0,0
DFN10_3X3 = smd 0.3 x 0.85: 1 -1,-1.55; 2 -0.5,-1.55; 3 0,-1.55; 4 0.5,-1.55; 5 1,-1.55; 6 1,1.55; 7 0.5,1.55; 8 0,1.55; 9 -0.5,1.55; 10 -1,1.55 | smd 2.48 x 1.55: EXP 0,0
RN41 = smd 0.8 x 1.6: 1 -6.6,-6.6; 2 -5.4,-6.6; 3 -4.2,-6.6; 4 -3,-6.6; 5 -1.8,-6.6; 6 -0.6,-6.6; 7 0.6,-6.6; 8 1.8,-6.6; 9 3,-6.6; 10 4.2,-6.6; 11 5.4,-6.6; 12 6.6,-6.6; 13 6.6,6.6; 14 5.4,6.6; 15 4.2,6.6; 16 3,6.6; 17 1.8,6.6; 18 0.6,6.6; 19 -0.6,6.6; 20 -1.8,6.6; 21 -3,6.6; 22 -4.2,6.6; 23 -5.4,6.6; 24 -6.6,6.6 | smd 1.6 x 0.8: 25 -9.4,4.8; 26 -9.4,3.2; 27 -9.4,1.6; 28 9.4,3.1; 29 9.4,-3.1; 30 9.4,-4.122; 31 9.4,-1.9; 32 9.4,-0.7; 33 9.4,0.7; 34 9.4,1.9; 35 9.4,4.122
LGA-14 = smd 0.6 x 0.9: 1 -2,-1; 2 -1.2,-1; 3 -0.4,-1; 4 0.4,-1; 5 1.2,-1; 6 2,-1; 8 2,1; 9 1.2,1; 10 0.4,1; 11 -0.4,1; 12 -1.2,1; 13 -2,1 | smd 0.9 x 0.6: 7 2,0; 14 -2,0
SOT23-5 = smd 0.55 x 1.2: 1 -0.95,-1.3; 2 0,-1.3; 3 0.95,-1.3; 4 0.95,1.3; 5 -0.95,1.3
CHIP-LED0603 = smd 0.8 x 0.8: A 0,-0.75; C 0,0.75
LED5MM_RGB_EDGE = smd 1.75 x 3.175 bottom: A -0.585,-1.6; B 1.971,-1.6 | smd 1.75 x 3.175: G 0.693,-1.6; R -1.863,-1.6
MIC-6MM = drill 0.5 pad 1.27: 1 -0.8,0.95; 2 -0.8,-0.95
SOT23 = smd 1 x 1.4: 1 -0.95,-1.1; 2 0.95,-1.1; 3 0,1.1
TACTILE_SWITCH_SMD = smd 1.524 x 0.762: 1 -2.54,1.905; 2 2.54,1.905; 3 -2.54,-1.905; 4 2.54,-1.905
SJ_2S-NO = smd 0.635 x 1.27: 1 -0.45,0; 2 0.45,0
SLOT = smd 3.175 x 1.27: P$1 2.032,1.27; P$2 2.032,-1.27 | smd 3.175 x 1.27 bottom: P$3 2.032,1.27; P$4 2.032,-1.27
MA06-1 = drill 1.016 long: 1 -6.35,0; 2 -3.81,0; 3 -1.27,0; 4 1.27,0; 5 3.81,0; 6 6.35,0
TP20SQ = smd 2 x 2: TP 0,0
5032 = smd 2.286 x 2.032: 1 -2.413,0; 2 2.413,0

### Placement (x,y rotation side)
BATTERY  31.15,49.43 270 top
BATTERY1  34.45,49.45 270 top
C1  30.94,66.6 90 top
C2  18.62,64.44 90 top
C3  32.34,25.59 135 top
C4  26.83,62.1 0 bottom
C5  26.83,64.13 0 bottom
C6  23.78,62.36 90 bottom
C7  33.28,58.7 0 top
C8  33.64,67.94 0 top
C9  10.19,65.07 0 bottom
C10  17.91,63.96 180 bottom
C11  33.68,98.15 225 bottom
C12  18.8,48.13 270 top
C13  27.95,48.13 270 top
C14  9.28,54.2 90 bottom
C15  34.54,88.16 90 top
C16  32.59,72.09 90 top
C17  26.3,35.23 0 top
C18  32.42,29.97 180 top
C19  32.42,37.03 0 top
C20  29.34,37.03 0 top
C21  14.13,54.48 270 bottom
C22  12.35,54.48 270 bottom
CHARGE  15.58,49.28 270 top
IC1  26.07,61.85 180 top
IC2  27.34,103.25 135 top
IC3  8.92,61.85 180 top
IC4  27.84,20.19 225 top
IC5  23.27,48.36 0 top
IC6  28.61,87 0 bottom
IC7  29.11,71.04 90 top
IC8  29.34,32.33 0 top
LED  26.17,83.74 0 top
LED1  41.41,121.13 21 top
LED2  4.91,84.6 69 top
LED3  7.59,33.02 117 top
LED4  35.34,118.43 27 top
LED5  2.83,78.28 75 top
LED6  10.91,27.26 123 top
LED7  29.58,115.11 33 top
LED8  1.45,71.78 81 top
LED9  14.82,21.89 129 top
LED10  24.21,111.2 39 top
LED11  0.75,65.17 87 top
LED12  19.26,16.95 135 top
LED13  19.26,106.75 45 top
LED14  0.75,58.53 93 top
LED15  24.21,12.5 141 top
LED16  14.84,101.79 51 top
LED17  1.45,51.92 99 top
LED18  29.58,8.59 147 top
LED19  10.96,96.41 57 top
LED20  2.83,45.42 105 top
LED21  35.34,5.27 153 top
LED22  7.61,90.65 63 top
LED23  4.88,39.09 111 top
LED24  41.41,2.57 159 top
MIC1  21.47,35.2 180 top
MODE  38.87,27.48 180 top
Q1  29.8,76.99 0 top
R1  32.24,96.83 135 top
R2  16.01,59.97 90 top
R3  34.69,23.32 135 top
R4  24.19,52.6 270 top
R5  22.21,52.63 270 top
R6  31.83,52.1 180 top
R7  25.94,76.71 270 top
R8  27.51,76.71 90 top
R9  32.32,76.71 270 top
R10  30.84,84.94 180 top
R11  34.75,85.01 0 top
R12  26.7,90.65 180 top
R13  32.82,88.14 270 top
R14  26.14,87.12 270 top
R15  26.32,36.78 180 top
R16  26.27,33.68 0 top
R17  29.34,35.46 180 top
R18  32.42,31.37 0 top
R19  32.42,28.45 0 top
R20  31.63,34.72 270 top
RST  38.13,40.21 90 top
S1  14.81,85.17 90 bottom
S2  16.16,37.46 0 bottom
SJ1  31.65,82.75 90 top
SJ2  33.94,82.78 90 top
SJ3  29.52,90.65 180 top
SJ4  32.85,90.7 270 top
SLOT1  46.39,11.05 180 top
SLOT2  46.39,112.65 180 top
SV1  16.85,73.48 270 top
TP1  42.04,64.57 0 top
TP2  40.04,64.57 0 top
TP3  41.97,59.36 0 top
TP4  39.99,59.36 0 bottom
TP5  42.04,64.57 0 bottom
TP6  40.04,64.57 0 bottom
TP7  43.97,59.36 0 bottom
TP8  41.99,59.36 0 bottom
TP9  44.05,64.57 0 top
TP10  39.99,59.36 0 top
TP11  44.05,64.57 0 bottom
TP12  43.95,59.36 0 top
X1  33.38,63.3 270 top

### Tracks (layer width: path | path; a pad name or v marks a point on that pad's centre or on a via)
!CS
  Top 0.406: IC1.14 24.87,73.13 26.14,74.4 28.73,74.4 29.11,74.02 IC7.7
BATTSENSE
  Top 0.406: IC1.28 25.67,55.01 28.58,52.09 R6.2
BLANK  (via drill 0.36)
  Top 0.254: v13.24,68.07 13.24,68.96 12.58,69.62 12.22,69.62 10.5,71.35 10.5,83.67 23.5,96.67 26.63,96.67 29.24,99.29 30.05,99.29 arc177 30.11,101.55 30.1,101.55 | v13.42,62.81 13.4,62.6 IC3.30 | IC4.30 30.62,24.03 v30.87,24.87 | v25.13,27.79 24.95,27.61 22.18,27.61 14.69,35.1 13.09,35.1 10.37,37.82 10.37,52.6 14.08,56.31 v14.08,60.25 | IC1.25 23.19,57.48 19.13,57.48 18.52,58.09 v18.45,58.09 | 30.1,101.55 IC2.30 | 30.1,101.55 30.1,101.57 v30.87,101.4 | 44.33,111.4 SLOT2.P$3
  Top 0.406: v42.35,111.4 44.33,111.4
  Bottom 0.254: v13.42,62.81 18.14,58.09 v18.45,58.09 | v14.08,60.25 13.42,60.91 v13.42,62.81 | v25.13,27.79 27.95,27.79 v30.87,24.87 | v42.35,111.4 42.37,111.38 | v13.24,68.07 13.44,67.79 13.44,67.26 13.67,67.11 13.67,63.91 13.42,63.65 v13.42,62.81
  Bottom 0.406: v30.87,101.4 40.87,111.4 v42.35,111.4 | 42.37,111.38 SLOT2.P$3
BT_PWR  (via drill 0.36)
  Top 0.305: IC1.32 28.87,59.02 26.4,61.49 25.3,61.49 23.07,63.73 23.07,64.72 23.07,64.92 22.49,65.51 v22.49,73 | v25,74.52 25.94,75.46 R7.2
  Bottom 0.305: v22.49,73 24.01,74.52 v25,74.52
BT_RST
  Bottom 0.254: S1.4 14.69,85.93 14.69,82.5 15.91,81.28 20.2,81.28 22.33,83.41 28.66,83.41 30.38,81.69 30.38,80.42
  Bottom 0.305: 30.38,80.42 IC6.5
BUTTON  (via drill 0.36)
  Top 0.406: v30.31,57.81 30.36,57.86 IC1.1
  Bottom 0.254: 18.65,35.46 S2.3
  Bottom 0.406: MODE.2 34.5,27.48 33.1,28.88 25.38,28.88 23.6,28.88 18.7,33.78 S2.3 18.7,36.12 21.19,38.61 22.79,38.61 29.55,45.36 29.55,56.21 30.31,56.97 v30.31,57.81
CHARGE
  Top 0.254: IC5.1 21.92,46.46 21.82,46.46 | 21.82,46.46 C12.A | 22.13,47.07 22.82,47.07 22.82,46.46 21.82,46.46 | 21.82,46.46 21.82,46.56
  Top 0.305: IC5.2 IC5.1 22.27,46.74
  Top 0.813: 22.27,46.74 CHARGE.2
COL1  (via drill 0.36)
  Top 0.254: IC2.1 33.18,106.62 33.18,108.33 38.77,113.92 39.02,113.92 41.56,116.46 42.83,116.46 43.11,116.46 44.35,117.7 44.35,120.04 44.63,120.32 v44.63,120.6
  Bottom 0.305: LED1.B 44.1,120.07 v44.63,120.6
COL2
  Top 0.254: IC2.2 32.67,106.82 32.67,108.58 38.51,114.43 38.77,114.43 41.31,116.97 42.02,116.97 43.21,118.16 43.21,119.31 LED1.G
COL3
  Top 0.254: IC2.3 32.16,107.02 32.16,108.84 38.26,114.94 38.51,114.94 40.29,116.71 40.29,118.75 LED1.R
COL4  (via drill 0.36)
  Top 0.254: IC2.4 31.65,107.22 31.65,109.09 37.67,115.09 38.97,116.38 38.97,117.6 38.97,117.86 v38.59,118.24
  Bottom 0.254: LED4.B arc-90 38.46,117.25 38.46,118.11 v38.59,118.24
COL5
  Top 0.254: IC2.5 31.15,107.41 31.15,109.35 37.32,115.52 37.32,116.15 36.68,116.79 LED4.G
COL6
  Top 0.254: IC2.6 30.64,107.61 30.64,109.6 35.08,114.05 35.08,114.96 34.4,115.64 LED4.R
COL7  (via drill 0.36)
  Top 0.254: IC2.7 30.13,107.81 30.13,110.11 32.92,112.9 33.36,113.33 33.36,114.76 v32.85,115.26
  Bottom 0.254: LED7.B 32.11,114.36 v32.85,115.26
COL8
  Top 0.254: IC2.8 29.62,108.01 29.62,110.36 31.65,112.39 31.65,113.06 31.5,113.21 31.5,113.67 LED7.G
COL9
  Top 0.254: IC2.9 26.32,106.74 26.32,106.81 28.86,109.35 28.86,112.39 LED7.R
COL10  (via drill 0.36)
  Top 0.254: IC2.10 25.81,106.54 25.81,107.06 27.59,108.84 28.15,109.4 28.15,110.31 28.15,110.97 v27.44,111.68
  Bottom 0.254: 26.74,110.88 LED10.B 26.95,111.19 v27.44,111.68 27.59,110.03
COL11
  Top 0.254: IC2.11 25.3,106.34 25.3,107.31 26.57,108.58 26.57,109.09 25.51,110.16 LED10.G
COL12
  Top 0.254: IC2.12 24.72,106.22 24.72,107.83 LED10.R
COL13  (via drill 0.36)
  Top 0.254: IC2.13 22.92,107.31 v22.41,107.57
  Bottom 0.254: LED13.B v22.41,107.57
COL14
  Top 0.254: IC2.14 24.07,105.46 21.9,105.46 21.25,106.11 LED13.G
COL15
  Top 0.254: IC2.15 24.04,104.78 22.76,104.78 21.75,103.76 20.05,103.76 19.5,104.3 LED13.R
COL16  (via drill 0.36)
  Top 0.254: IC2.16 24.1,104.01 22.76,104.01 21.24,102.49 20.35,102.49 19.79,101.93 18.6,101.93 17.89,102.64 v17.89,102.92
  Bottom 0.254: LED16.B 17.51,102.31 v17.89,102.92
COL17
  Top 0.254: IC2.17 23.34,101.73 20.73,101.73 19.21,100.2 17.43,100.2 16.53,101.1 LED16.G
COL18
  Top 0.254: IC2.18 23.54,101.22 20.99,101.22 17.99,98.22 16.31,98.22 15.2,99.33 LED16.R
COL19  (via drill 0.36)
  Top 0.254: IC2.19 23.74,100.71 21.24,100.71 17.94,97.41 17.46,96.93 15.27,96.93 14.71,96.93 v13.82,97.81
  Bottom 0.254: LED19.B 13.6,97.41 v13.82,97.81
COL20
  Top 0.254: IC2.20 23.94,100.2 21.49,100.2 16.16,94.87 13.93,94.87 LED19.G 12.86,95.88
COL21
  Top 0.254: IC2.21 24.13,99.69 21.75,99.69 15.12,93.07 12.66,93.07 11.75,93.97 LED19.R
COL22  (via drill 0.36)
  Top 0.254: IC2.22 24.33,99.19 22,99.19 14.89,92.07 14.59,91.77 11.46,91.77 10.98,91.77 v10.34,92.41
  Bottom 0.254: LED22.B 10.43,91.68 arc90 v10.34,92.41
COL23
  Top 0.254: IC2.23 24.53,98.68 22.51,98.68 13.37,89.53 10.93,89.53 10.55,89.92 9.98,89.92 LED22.G 10.07,90.29
COL24
  Top 0.254: IC2.24 24.73,98.17 22.76,98.17 12.07,87.48 8.98,87.48 LED22.R
COL25  (via drill 0.36)
  Top 0.254: IC3.1 10.67,68.61 8.79,70.48 8.79,85.9 8.21,86.49 7.63,86.49 v7.45,86.66
  Bottom 0.254: LED2.B 7.59,85.87 arc90 v7.45,86.66
COL26
  Top 0.254: IC3.2 10.17,68.35 8.29,70.23 8.29,83.9 7.91,84.28 7.05,84.28 LED2.G
COL27
  Top 0.254: IC3.3 9.67,68.08 7.78,69.98 7.78,81.1 7.04,81.84 6.19,81.84 LED2.R
COL28  (via drill 0.36)
  Top 0.254: IC3.4 9.17,67.82 7.27,69.72 7.27,78.89 7.27,79.32 6.15,80.44 5.29,80.44 v5.16,80.57
  Bottom 0.254: LED5.B 5.46,79.77 v5.16,80.57
COL29
  Top 0.254: IC3.5 8.67,67.56 6.76,69.47 6.76,77.37 6,78.13 4.96,78.13 LED5.G
COL30
  Top 0.254: IC3.6 8.17,67.3 6.25,69.22 6.25,74.73 5.26,75.72 4.25,75.72 LED5.R
COL31  (via drill 0.36)
  Top 0.254: IC3.7 7.67,67.04 5.75,68.96 5.75,72.85 5.75,73.28 4.83,74.19 3.64,74.19 v3.51,74.32
  Bottom 0.254: LED8.B 4.04,73.48 v3.51,74.32
COL32
  Top 0.254: IC3.8 7.17,66.77 5.24,68.71 5.24,71.35 4.55,72.03 3.32,72.03 LED8.G
COL33
  Top 0.254: IC3.9 6.03,63.6 5.49,64.13 5.49,66.93 2.85,69.57 LED8.R
COL34  (via drill 0.36)
  Top 0.254: IC3.10 6.4,63.12 5.75,63.12 4.98,63.88 4.98,65.99 4.98,66.45 3.69,67.74 2.72,67.74 v2.55,67.92
  Bottom 0.254: LED11.B 2.75,67.06 v2.55,67.92
COL35
  Top 0.254: LED11.G 2.44,65.41 3.71,65.41 4.48,64.64 4.48,63.63 5.5,62.6 IC3.11
COL36
  Top 0.254: IC3.12 2.95,62.1 2.29,62.76 LED11.R
COL37  (via drill 0.36)
  Top 0.254: IC3.13 2.95,61.59 2.39,61.59 v2.24,61.44
  Bottom 0.254: LED14.B 2.25,60.78 v2.24,61.44
COL38
  Top 0.254: 6.42,61.09 IC3.14 4.43,61.1 LED14.G
COL39
  Top 0.254: IC3.15 5.26,60.6 4.73,60.07 4.73,57.35 4.25,56.87 2.57,56.87 LED14.R
COL40  (via drill 0.36)
  Top 0.254: IC3.16 6.42,57.7 6.42,57.32 4.32,55.22 4.07,54.97 v2.62,54.97
  Bottom 0.254: LED17.B 2.72,54.35 v2.62,54.97
COL41
  Top 0.254: IC3.17 7.17,56.92 5.24,54.99 5.24,53.9 4.45,53.11 3.18,53.11 LED17.G 3.13,52.7
COL42
  Top 0.254: IC3.18 7.67,56.66 5.75,54.74 5.75,51.31 5.06,50.62 3.62,50.62 LED17.R
COL43  (via drill 0.36)
  Top 0.254: IC3.19 8.17,56.4 6.25,54.48 6.25,50.16 4.65,48.56 v3.69,48.56
  Bottom 0.254: LED20.B 3.87,48.31 v3.69,48.56
COL44
  Top 0.254: IC3.20 8.67,56.14 6.76,54.23 6.76,47.37 4.68,46.61 LED20.G
COL45
  Top 0.254: IC3.21 9.17,55.88 7.27,53.97 7.27,45.19 6.61,44.53 LED20.R
COL46  (via drill 0.36)
  Top 0.254: IC3.22 9.67,55.61 7.78,53.72 7.78,43.56 6.53,42.32 v5.42,42.32
  Bottom 0.254: LED23.B v5.42,42.32
COL47
  Top 0.254: IC3.23 10.17,55.35 8.29,53.47 8.29,41.02 LED23.G 6.73,40.51
COL48
  Top 0.254: IC3.24 10.67,55.09 8.79,53.21 8.79,38.91 8.24,38.35 7.47,38.35 LED23.R
COL49  (via drill 0.36)
  Top 0.254: IC4.1 24.48,26.03 21.49,26.03 13.87,33.66 12.35,33.66 9.66,36.35 7.85,36.35 v7.78,36.27
  Bottom 0.254: LED3.B 8.26,35.64 v7.78,36.27
COL50
  Top 0.254: IC4.2 24.28,25.53 21.24,25.53 13.62,33.15 12.1,33.15 10.34,34.9 9.56,34.9 9.02,34.36 LED3.G
COL51
  Top 0.254: IC4.3 24.08,25.02 20.99,25.02 13.49,32.51 10.95,32.51 10.53,32.09 LED3.R
COL52  (via drill 0.36)
  Top 0.254: IC4.4 23.88,24.51 20.73,24.51 14.56,30.68 14.38,30.86 11.54,30.86 11.13,30.86 v10.78,30.5
  Bottom 0.254: v10.78,30.5 11.36,29.79 LED6.B
COL53
  Top 0.254: IC4.5 23.68,24 20.48,24 14.89,29.59 13.06,29.59 12.19,28.72 LED6.G
COL54
  Top 0.254: IC4.6 23.48,23.49 20.22,23.49 16.36,27.36 14.33,27.36 13.55,26.57 LED6.R
COL55  (via drill 0.36)
  Top 0.254: IC4.7 23.28,22.99 19.97,22.99 17.81,25.15 17,25.96 15.17,25.96 v14.33,25.12
  Bottom 0.254: LED9.B 14.87,24.47 v14.33,25.12
COL56
  Top 0.254: IC4.8 23.08,22.48 19.72,22.48 17.94,24.26 16.92,24.26 15.86,23.19 LED9.G
COL57
  Top 0.254: IC4.9 22.78,21.72 17.18,21.72 17.23,21.66 LED9.R
COL58  (via drill 0.36)
  Top 0.254: IC4.10 24.81,18.92 23.53,18.92 21.55,20.9 19.49,20.9 18.7,20.12 v18.42,20.12
  Bottom 0.254: LED12.B v18.42,20.12
COL59
  Top 0.254: IC4.11 25.01,18.41 23.27,18.41 22,19.68 21.04,19.68 19.92,18.57 LED12.G 20.16,18.35
COL60
  Top 0.254: IC4.12 25,17.7 22.54,17.7 arc90 22.21,17.37 22.21,17.25 arc-90 LED12.R
COL61  (via drill 0.36)
  Top 0.254: IC4.13 23.55,15.54 v23.07,15.54
  Bottom 0.254: LED15.B 23.68,15.88 v23.07,15.54
COL62
  Top 0.254: IC4.14 25.56,16.85 25.56,15.11 24.91,14.47 LED15.G
COL63
  Top 0.254: IC4.15 26.07,16.65 26.07,16.13 27.49,14.71 27.49,13.31 26.75,12.57 LED15.R
COL64  (via drill 0.36)
  Top 0.254: IC4.16 26.83,16.7 26.83,16.13 28.63,14.33 28.86,14.1 28.86,12.57 28.86,12.22 v28.15,11.51
  Bottom 0.254: LED18.B 28.67,11.01 v28.15,11.51
COL65
  Top 0.254: IC4.17 29.88,15.69 29.88,13.08 30.89,12.06 30.89,11.3 30.13,10.54 LED18.G
COL66
  Top 0.254: IC4.18 30.38,15.88 30.38,13.33 32.77,10.95 32.77,10.08 32.02,9.33 LED18.R
COL67  (via drill 0.36)
  Top 0.254: IC4.19 30.89,16.08 30.89,13.59 34.19,10.29 34.19,8.66 v33.56,8.03
  Bottom 0.254: LED21.B 34.1,7.59 v33.56,8.03
COL68
  Top 0.254: IC4.20 31.4,16.28 31.4,13.84 36.48,8.76 36.48,8.25 35.72,7.5 LED21.G
COL69
  Top 0.254: IC4.21 31.91,16.48 31.91,14.1 38.36,7.64 38.36,6.91 37.72,6.27 LED21.R
COL70  (via drill 0.36)
  Top 0.254: IC4.22 32.42,16.68 32.42,14.35 39.66,7.11 39.71,7.06 39.71,5.82 39.71,5.46 v39.35,5.1
  Bottom 0.254: LED24.B 39.66,5.25 v39.35,5.1
COL71
  Top 0.254: IC4.23 32.92,16.88 32.92,14.6 40.8,6.73 41.31,6.73 42.07,5.97 42.07,5.46 41.62,5.02 LED24.G
COL72
  Top 0.254: IC4.24 33.43,17.08 33.43,14.86 41.05,7.24 42.42,7.24 44.43,5.23 LED24.R
GND  (via drill 0.36)
  Top 0.254: v30.23,100.89 30.05,100.89 IC2.29 | IC7.2 30.13,69.83 | 23.04,50.75 23.04,50.18 arc-90 IC5.9
  Top 0.305: C1.2 31.91,68.45 31.91,69.47 31.65,69.72 30.24,69.72 IC7.2
  Top 0.61: v23.27,48.72 22.99,49 22.99,49.43 23.04,49.48 23.04,50.75
  other vias: 16.34,58.39 14.84,62.69 22.46,48.74 24.09,48.72 22.46,47.96 23.27,47.96 24.09,47.96 43.16,114.17 14.26,80.95 20.28,61.34 23.91,64.47
  pour Top: 47.86,124.69 47.73,124.69 47.73,94.64 37.6,94.51 37.6,79.38 47.73,79.5 47.86,-1.5 -2.05,-1.47 -2.05,124.71
  pour Bottom: -3.65,127.13 -3.65,-5.49 48.29,-5.36 48.29,79.35 37.6,79.43 37.6,94.34 48.47,94.41 48.47,95.07 48.65,127.25 48.29,127.25
HOLE  (via drill 0.36)
  Top 0.254: IC2.27 29.24,100.28 v29.29,99.92 | v31.17,98.02 31.57,97.62 R1.2
  Bottom 0.254: v29.29,99.92 31.15,98.02 v31.17,98.02
INT1/DRDY
  Top 0.406: IC1.13 25.66,71.98 26.72,73.04 IC7.8
INT2
  Top 0.406: IC1.12 26.45,66.16 26.45,71.7 26.99,72.24 IC7.9
MIC  (via drill 0.36)
  Top 0.254: IC8.1 28.4,31.98 28.81,32.38 30.99,32.38 31.63,33.02 R20.2 v31.63,34.37 | v28.43,37.69 28.38,36.98 C20.1 | v24.09,59.56 23,60.65 IC1.22
  Top 0.406: v28.43,37.69 38.54,47.75 v38.54,56.87
  Bottom 0.254: v31.63,34.37 28.89,37.11 v28.43,37.69
  Bottom 0.406: v24.09,59.56 35.85,59.56 v38.54,56.87
MISO
  Top 0.406: IC1.16 23.27,74.5 arc90 20.48,77.29 SV1.2
MOSI
  Top 0.406: IC1.15 24.07,75.46 arc90 19.64,79.88 16.9,79.88 arc90 SV1.1
N$1
  Top 0.254: IC5.7 23.77,51.7 R4.2
N$2
  Top 0.254: IC3.27 15.83,61.1 R2.2
N$3
  Top 0.254: IC2.25 25.31,97.69 22.99,97.69 9.38,84.07 9.38,70.79 11.42,68.75 IC3.32
N$4
  Top 0.254: LED.C 26.17,86.2 R14.2
N$5
  Top 0.254: R10.1 31.74,83.29 arc-90 SJ1.2
N$6
  Top 0.254: IC5.10 22.27,51.73 R5.2
N$7
  Top 0.406: C7.1 33.38,59.7 X1.2 33.38,62.46 31.99,63.85 IC1.7
N$8
  Top 0.406: C8.1 32.74,66.36 X1.1 32.32,64.65 IC1.8
N$9
  Top 0.254: IC4.27 32.05,23.34 33.41,23.34 34.02,23.96 R3.2
N$10  (via drill 3.17)
  other vias: 42.58,21.21
N$11  (via drill 3.17)
  other vias: 42.58,49.15
N$12  (via drill 3.17)
  other vias: 42.58,102.44
N$13  (via drill 3.17)
  other vias: 42.58,74.55
N$14
  Top 0.406: C17.2 27.42,35.46 R17.2
N$15
  Top 0.406: R16.1 25.37,35.2 C17.1 23.19,35.23 MIC1.1
N$16
  Top 0.305: R19.1 C18.2 31.54,30 R18.1 30.6,31.34 IC8.3
N$17
  Top 0.406: R17.1 C20.2 C19.1 | R17.1 30.41,35.62 R20.1 | R17.1 30.29,35.41 IC8.4
N$18
  Top 0.254: R7.1 27.51,76.07 R8.1 27.53,75.89 Q1.1
N$19
  Top 0.254: IC4.32 24.98,26.59 21.7,26.59 14.13,34.16 12.63,34.16 9.28,37.52 9.28,53.01 11.42,55.15 IC3.25
N$20
  Top 0.406: MIC1.2 22.89,36.78 R15.2
N$21
  Top 0.254: SJ3.2 R12.1
N$23
  Top 0.254: R11.1 33.85,83.32 arc90 SJ2.2
N$24
  Top 0.254: SJ4.2 32.82,90.23 R13.1
PIO3  (via drill 0.36)
  Top 0.254: v30.38,92 29.97,91.58 SJ3.1
  Bottom 0.254: v30.38,92 30.38,93.57 30.38,93.59 IC6.20
PIO4  (via drill 0.36)
  Top 0.254: v32.77,92.41 32.85,92.33 SJ4.1
  Bottom 0.254: v32.77,92.41 32.77,93.56 32.77,93.59 IC6.22
PIO5  (via drill 0.36)
  Top 0.254: R14.1 30.6,88.02 31.4,88.82 31.4,91.95 v31.55,92.1
  Bottom 0.254: v31.55,92.1 31.55,93.54 31.55,93.59 IC6.21
PIO6  (via drill 0.36)
  Top 0.254: SJ2.1 v33.86,81.76
  Bottom 0.254: 32.8,81.23 arc-90 32.81,81.22 | v33.86,81.76 32.8,81.23 | 32.8,81.23 32.81,81.23 IC6.3
PIO7  (via drill 0.36)
  Top 0.254: v31.6,81.76 31.6,82.25 SJ1.1
  Bottom 0.254: v31.61,81.76 v31.6,81.76 v31.61,81.76 IC6.4
RST  (via drill 0.36)
  Top 0.254: v12.93,74.35 12.93,72.31 15.5,69.75 16.77,69.75 SV1.5
  Top 0.406: IC1.29 26.47,55.43 28.1,53.8 35.74,53.8 | 35.74,53.8 37.65,55.7 37.65,66.9 v37.7,66.95 | 35.74,53.8 37.19,52.35 v37.19,48.23
  Bottom 0.254: v12.93,74.35 S1.3
  Bottom 0.406: v37.7,66.95 21.52,66.95 18.85,69.62 16.9,69.62 SV1.5 | v37.19,48.23 38.13,47.29 RST.2
RX  (via drill 0.36)
  Top 0.406: IC1.30 27.26,55.68 28.35,54.58 35.57,54.58 36.81,55.83 36.81,76.89 33.64,80.06 25.28,80.06 23.2,82.14 v23.2,91.29
  Bottom 0.406: v23.2,91.29 v23.21,91.3 IC6.14
SCK
  Top 0.406: IC1.17 21.77,71.6 arc90 18.6,74.78 16.87,74.78 arc90 SV1.3
SCL/SPC
  Top 0.406: IC1.10 28.11,66.19 IC7.13
SCLK  (via drill 0.36)
  Top 0.254: v14.08,67.56 14.08,68.88 12.83,70.13 12.6,70.13 11.11,71.63 11.11,83.57 23.73,96.19 26.88,96.19 29.47,98.78 29.88,98.78 arc90 31.63,100.46 31.63,101.52 31.12,102.03 30.31,102.03 30,102.34 30,102.37 IC2.31 | IC3.31 12.78,63.1 12.78,63.12 13.09,63.42 v14.08,63.42 16.01,63.42 17.56,61.87 v17.56,60.58 17.56,57.71 17.25,57.4 15.86,57.4 10.85,52.4 10.85,38 13.29,35.56 14.89,35.56 22.03,28.42 27.41,28.42 30.23,25.6 30.23,24.35 IC4.31 | TP10.TP arc90 v39.4,59.36 TP3.TP | TP12.TP TP8.TP | TP8.TP TP3.TP | TP3.TP 39.27,59.36 v39.27,60.65 | TP3.TP TP8.TP
  Top 0.406: IC1.24 19.72,59.05 18.19,60.58 v17.56,60.58 | v39.27,60.65 39.27,59.71 39.63,59.71 TP10.TP
  Bottom 0.254: v39.27,60.65 17.61,60.63 arc90 v17.56,60.58 | v14.08,67.56 v14.08,63.42 | TP7.TP v39.4,59.36
  Bottom 0.406: TP10.TP 39.27,60.07 v39.27,60.65
SDA/SDI/SDO
  Top 0.406: IC1.11 27.23,66.17 27.23,69.72 27.36,69.84 IC7.12
SDO
  Top 0.406: IC7.14 29.11,68.27 28.87,68.03 IC1.9
SIN  (via drill 0.36)
  Top 0.254: IC2.32 30.54,102.92 31.07,102.92 32.16,101.83 32.16,100.74 arc-90 30,98.35 27.34,95.68 23.96,95.68 11.69,83.41 11.69,71.91 14.71,68.88 14.71,65.58 v14.98,65.32 20.45,59.85 IC1.23
  Bottom 0.254: TP5.TP TP6.TP | TP5.TP TP11.TP | TP5.TP 43.02,64.57 43.02,64.55
  Bottom 0.406: v14.98,65.32 40.04,65.32 TP6.TP
SOUT
  Top 0.254: 44.84,65.25 44.74,65.25 TP9.TP TP1.TP TP2.TP
  Top 0.406: IC4.25 38.56,20.72 45.65,27.81 45.65,63.86 45.12,64.39 42.22,64.39 TP1.TP
STAT
  Top 0.406: IC1.27 24.87,53.5 R4.1
TX  (via drill 0.36)
  Top 0.406: IC1.31 28.07,55.88 28.68,55.27 35.11,55.27 36,56.16 36,76.5 33.36,79.15 24.85,79.15 21.98,82.02 v21.98,91.95
  Bottom 0.406: v21.98,91.95 22.01,91.98 IC6.13
VCC  (via drill 0.36, 0.61)
  Top 0.254: v16.03,62.28 13.7,61.6 IC3.28 | v28.81,62.28 28.73,62.28 | v30.18,100.05 IC2.28 | C3.1 29.81,21.78 | C3.1 32.97,25.09 | v36.4,25.09 36.02,25.48 33.48,25.48 32.97,24.97 C3.1 | IC1.6 arc-90 30.48,63.17 | v12.35,65.1 13.16,64.29 v14.89,64.29 | IC5.3 IC5.4 23.78,45.72 | 23.45,45.72 23.27,45.9 IC5.3 | IC5.3 23.45,46.63 23.45,45.97 23.6,46.13 23.6,46.63 23.27,46.3 23.27,45.69 | v31.27,73.02 31.27,74.52 30.74,75.06 30.74,75.88 Q1.2 30.75,76.06 29.83,76.99 28.18,76.99 R8.2 | IC4.28 29.81,21.78 | 29.81,21.78 | SLOT1.P$1 42.4,9.78 | 42.3,9.65 42.3,9.78 | 18.99,63.54 C2.1 arc90 19.92,62.25 20.15,62.25 | 20.15,62.25 IC1.20 | v20.12,62.25 20.15,62.25
  Top 0.305: C3.1 33.11,24.95 34.5,26.34 34.5,30.91 34.07,31.34 R18.2 33.34,31.96 v33.92,32.54 | IC7.1 29.85,68.78 29.85,65.68 | 29.85,65.68 29.85,65.61 28.78,64.54 v28.78,64.11 | C1.1 30.93,65.68 29.85,65.68 | IC5.3 IC5.4 | R6.1 32.72,52.09 32.72,46.89 | v28.78,64.11 arc67 29.5,63.04 IC1.6 | v28.81,62.28 28.78,62.28 v28.78,64.11 | v23.4,61.92 23.08,62.25 IC1.20
  Top 0.406: v28.81,62.28 arc90 29.92,61.45 IC1.4 | 20.02,64.39 arc90 20.56,63.85 IC1.18 | 20.02,64.39 20.02,70.51 arc99 17.94,72.29 | 17.94,72.29 arc-10 SV1.4 17.94,72.29 | C2.1 19.02,63.54 19.17,63.54 arc90 20.02,64.39 | IC7.6 30.13,73.02 v31.27,73.02 32.55,73.02 C16.2 | IC7.1 v31.27,69.04 | R16.2 27.22,33.63 v27.72,33.63 IC8.5 | IC1.20 21.81,62.28 | Q1.2 30.75,75.86 32.26,75.86 arc-90 R9.2
  Top 0.61: 23.78,45.72 23.45,45.72
  Top 0.813: BATTERY.2 30.64,46.38 C13.A 26.57,45.72 23.78,45.72
  Top 1.27: 34.45,46.94 34.45,46.89 32.72,46.89 BATTERY.2 31.15,45.62 31.15,45.11 31.15,43.89 28.78,41.53 25.89,38.63 v12.05,38.63 | v44.35,8.36 SLOT1.P$1 42.3,9.78 42.2,9.78 v41.71,10.26 | v40.62,16.89 40.62,11.33 42.3,9.65
  Bottom 0.254: 26.75,107.44 26.75,103.48 v30.18,100.05 31.78,100.05 C11.1 | C9.1 11.12,65.1 v12.35,65.1 | 16.03,63.14 v14.89,64.29 | 16.03,63.14 v16.03,62.28 16.06,62.25 | 44.33,9.75 SLOT1.P$1 | v44.35,8.36 44.3,8.36 | 38.64,18.85 38.64,18.87 38.64,18.95 38.59,19 | 34.4,46.84 34.45,46.89 BATTERY1.2 | 12.02,38.63 v12.05,38.63 | 16.03,63.14 arc-90 16.85,63.96 C10.1 17.01,63.5 17,63.5 arc90 18.24,62.25 18.83,62.25 19.64,62.23 20.1,62.23 arc90 v20.12,62.25
  Bottom 0.305: 4.43,70.84 3.99,70.8 LED8.A | v33.92,32.54 32.82,33.63 v27.72,33.63 | v28.78,64.11 28.76,64.13 C5.1 | C6.1 23.4,61.46 v23.4,61.92
  Bottom 0.406: 42.07,118.24 LED1.A | 22.21,103.25 22.31,103.35 | 9.31,83.05 9.1,82.57 | 7.38,77.15 7.22,76.66 | 9.33,40.21 9.3,40.22 | 6.17,71 arc-90 7.41,72.24 7.41,72.21 SV1.4 19.64,72.21 23.4,75.97 24.24,75.97 29.83,75.97 31.25,74.55 31.25,73.05 v31.27,73.02 v31.27,69.04 | C4.1 27.83,62.28 v28.81,62.28 | C14.A arc90 9.65,55.48 12.25,55.48 arc-90 C22.1 C21.1
  Bottom 0.61: 42.07,118.24 42.58,117.04 37.12,114.17 | 37.12,114.17 LED4.A | 31.71,111.12 LED7.A | 31.71,111.12 37.12,114.17 | 26.75,107.44 LED10.A | 26.75,107.44 30.57,110.28 31.71,111.12 | LED13.A 22.21,103.25 20.85,101.63 | 26.75,107.44 22.31,103.35 18.22,98.53 | 18.22,98.53 LED16.A | 14.76,93.45 LED19.A | 18.22,98.53 14.76,93.45 | 11.54,88.16 LED22.A | 14.76,93.45 11.54,88.16 | 9.1,82.57 LED2.A | 11.54,88.16 9.31,83.05 7.38,77.15 6.17,71 6,70.41 | 7.22,76.66 LED5.A | 6,70.41 3.99,70.8 | 5.44,64.57 LED11.A | 6,70.41 5.44,64.57 | 5.29,58.17 LED14.A | 5.44,64.57 5.29,58.17 | 6.15,52.12 LED17.A | 5.29,58.17 6.15,52.12 | 7.4,46.02 LED20.A | 6.15,52.12 7.4,46.02 | LED23.A 9.33,40.21 9.21,40.46 7.4,46.02 | 11.77,34.72 LED3.A | 9.3,40.22 11.77,34.72 | 15.04,29.34 LED6.A | 11.77,34.72 15.04,29.34 | 18.8,24.36 LED9.A | 15.04,29.34 18.8,24.36 | 23.07,19.84 LED12.A | 18.8,24.36 23.07,19.84 | 27.69,15.7 LED15.A | 23.07,19.84 27.69,15.7 | 32.75,12.17 LED18.A | 27.69,15.7 32.75,12.17 | 38.06,9.09 LED21.A | 32.75,12.17 38.06,9.09 | LED24.A 43.64,6.68 38.06,9.09 | 27.69,15.7 v36.4,25.09 | 5.29,58.17 7.75,58.17 arc-90 9.35,56.57 9.35,55.93 arc-90 C14.A
  Bottom 0.813: 43.64,6.68 44.33,7.26 44.33,8.33
  Bottom 1.27: BATTERY.2 34.45,46.89 BATTERY1.2 | 34.4,46.84 34.4,38.68 41.64,31.44 41.64,25.65 38.59,22.61 38.59,19 | 44.33,8.33 44.33,9.75 | v41.71,10.26 42.2,9.78 SLOT1.P$1 | 38.64,18.85 38.66,18.85 v40.62,16.89 | 10.39,37.85 12.02,38.63
VDD  (via drill 0.36)
  Top 0.254: 33.43,87.24 R13.2 32.24,87.24 arc90 R10.2 | 33.43,87.24 arc-90 R11.2 | R10.2 27.73,87.15 25.3,87.15 24.69,87.76 24.69,90.04 25.28,90.63 25.78,90.63 R12.2 | v24.69,82.37 25.32,82.99 LED.A 28,82.99 arc90 R10.2 | Q1.3 29.47,78.42 29.47,78.59 29.37,78.49 | 33.43,87.24 C15.1
  Top 0.406: 29.37,78.49 24.24,78.49 20.94,81.79 v20.94,83.74 | v24.06,84.45 24.69,83.82 v24.69,82.37 | Q1.3 29.8,77.66 32.26,77.66 arc-90 R9.1
  Bottom 0.254: IC6.11 23.22,80.41
  Bottom 0.406: 23.22,80.41 23.22,81.66 23.93,82.37 v24.69,82.37 | v20.94,83.74 21.65,84.45 v24.06,84.45
XLAT  (via drill 0.36)
  Top 0.254: IC2.26 28.66,100.16 28.66,99.8 26.04,97.18 23.27,97.18 9.94,83.84 9.94,71.07 12.12,68.88 v12.15,68.88 | IC3.26 12.55,60.6 v12.53,60.38 12.53,55.5 9.84,52.81 9.84,37.62 12.83,34.62 14.41,34.62 21.93,27.1 v26.04,27.1 | v31.53,21.82 31.24,21.82 IC4.26 | IC1.26 24.03,57.52 24.03,55.6 arc90 v24.09,55.55 | 43.44,12.32 SLOT1.P$2
  Top 0.406: v31.53,21.82 31.93,21.41 v34.35,21.41 | v42.58,13.18 43.44,12.32
  Bottom 0.254: v26.04,27.1 31.32,21.82 v31.53,21.82 | v24.09,55.55 17.35,55.55 v12.53,60.38 12.53,63.4 13.24,64.11 13.24,66.45 12.6,67.08 12.6,68.43 v12.15,68.88 | 43.44,12.32 SLOT1.P$2
  Bottom 0.406: v34.35,21.41 v42.58,13.18 43.44,12.32

### Text on the board
tPlace: GND | BLANK | MOSI | MISO | SCK | VCC | RST | OUTPUT | nullspacelabs.com | GND | SCLK | nullspacelabs.com | Mic | charliex / mmca | XLAT | VCC
bPlace: GND | BLANK | Reset | INPUT | SCLK | Mode | nullspacelabs.com | XLAT | VCC